# EAGLE design Chestnut V2.0 (EAGLE 7.7.0)

## Sheet 1 of 8
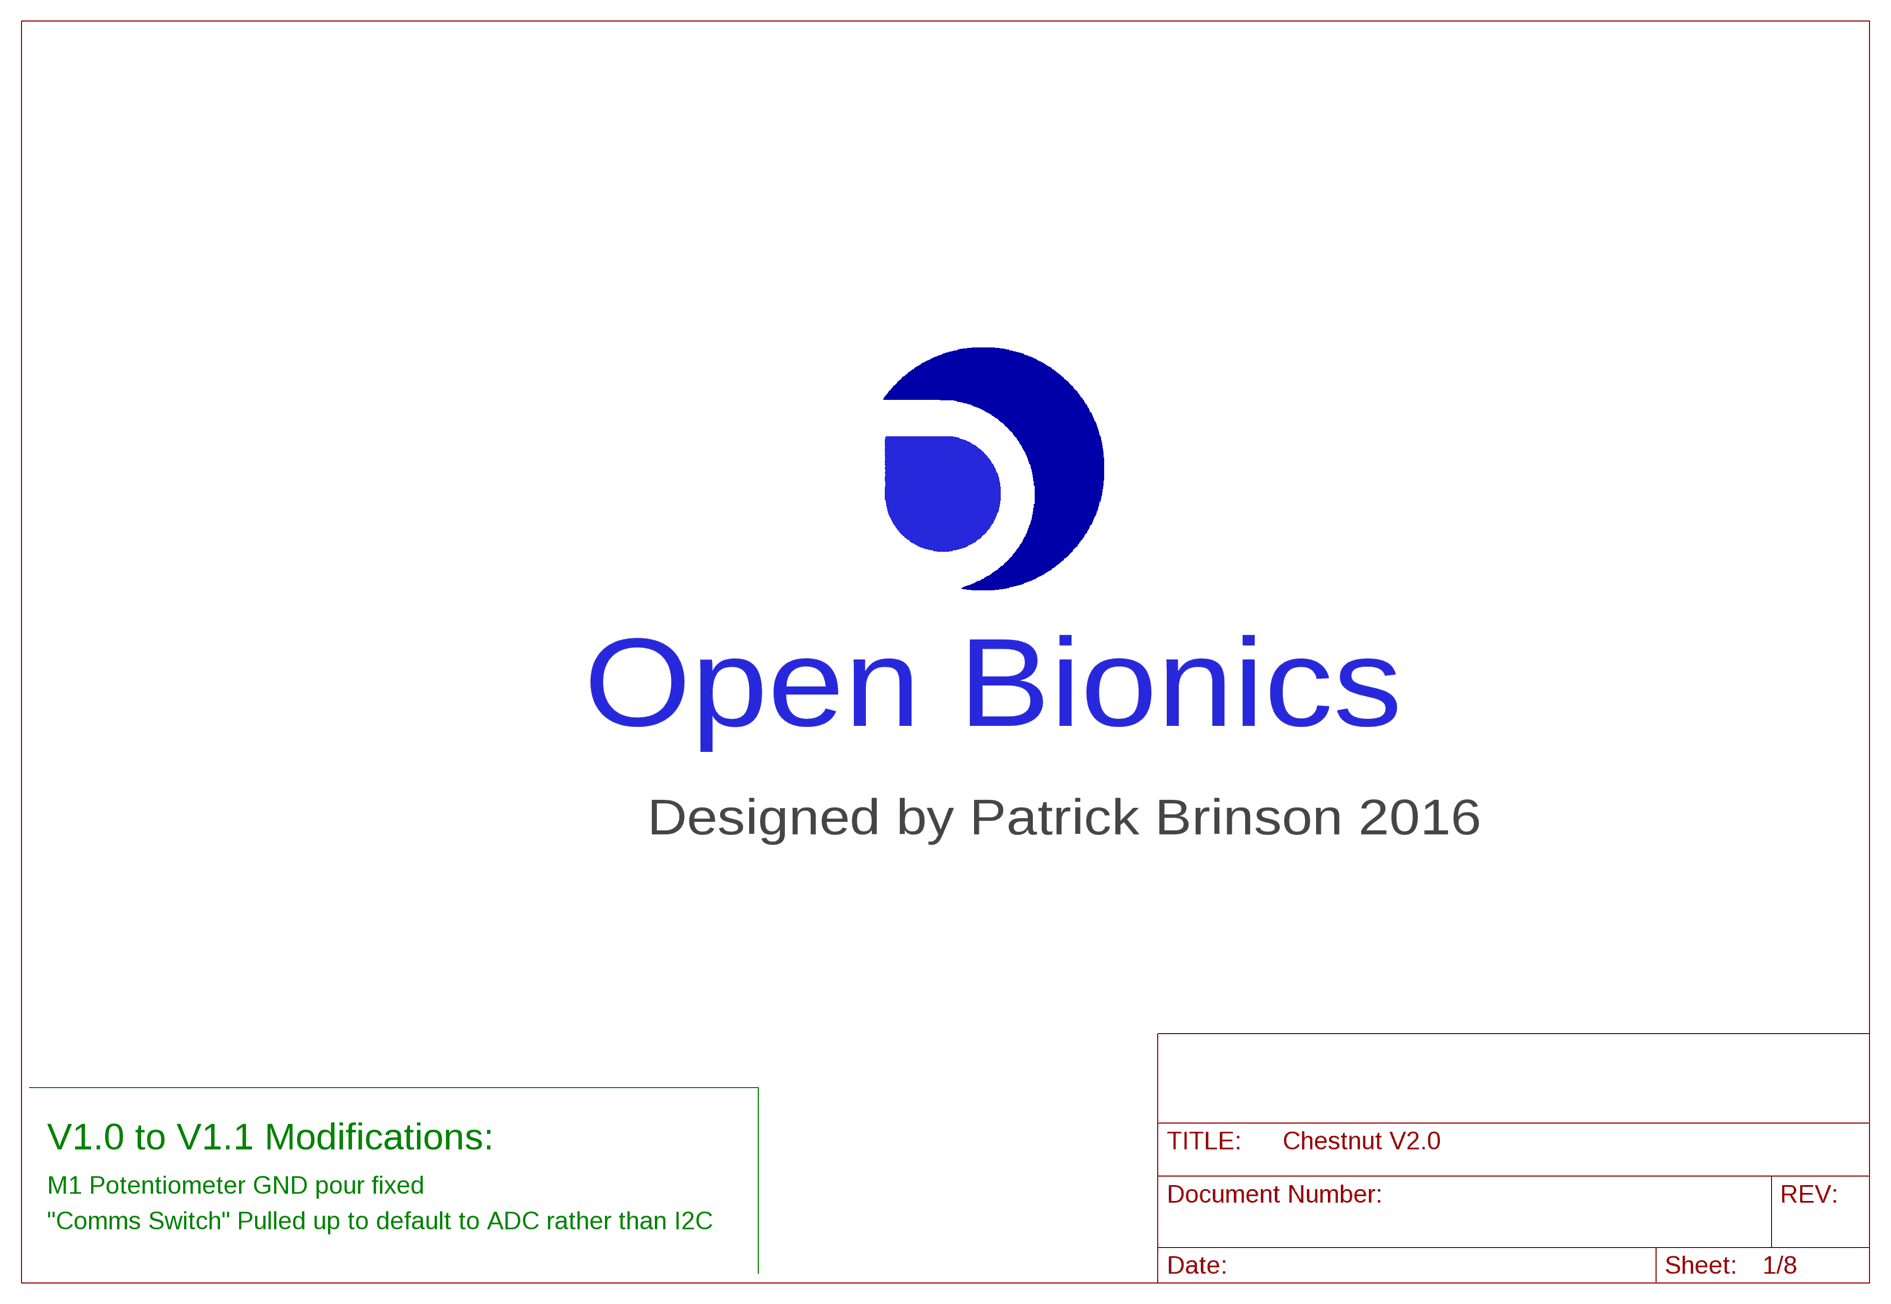
[diagram p0: schematic, sheet 1]

### Notes on the sheet
- Open Bionics
- Designed by Patrick Brinson 2016
- V1.0 to V1.1 Modifications:
- M1 Potentiometer GND pour fixed
- "Comms Switch" Pulled up to default to ADC rather than I2C

## Sheet 2 of 8: COMMS
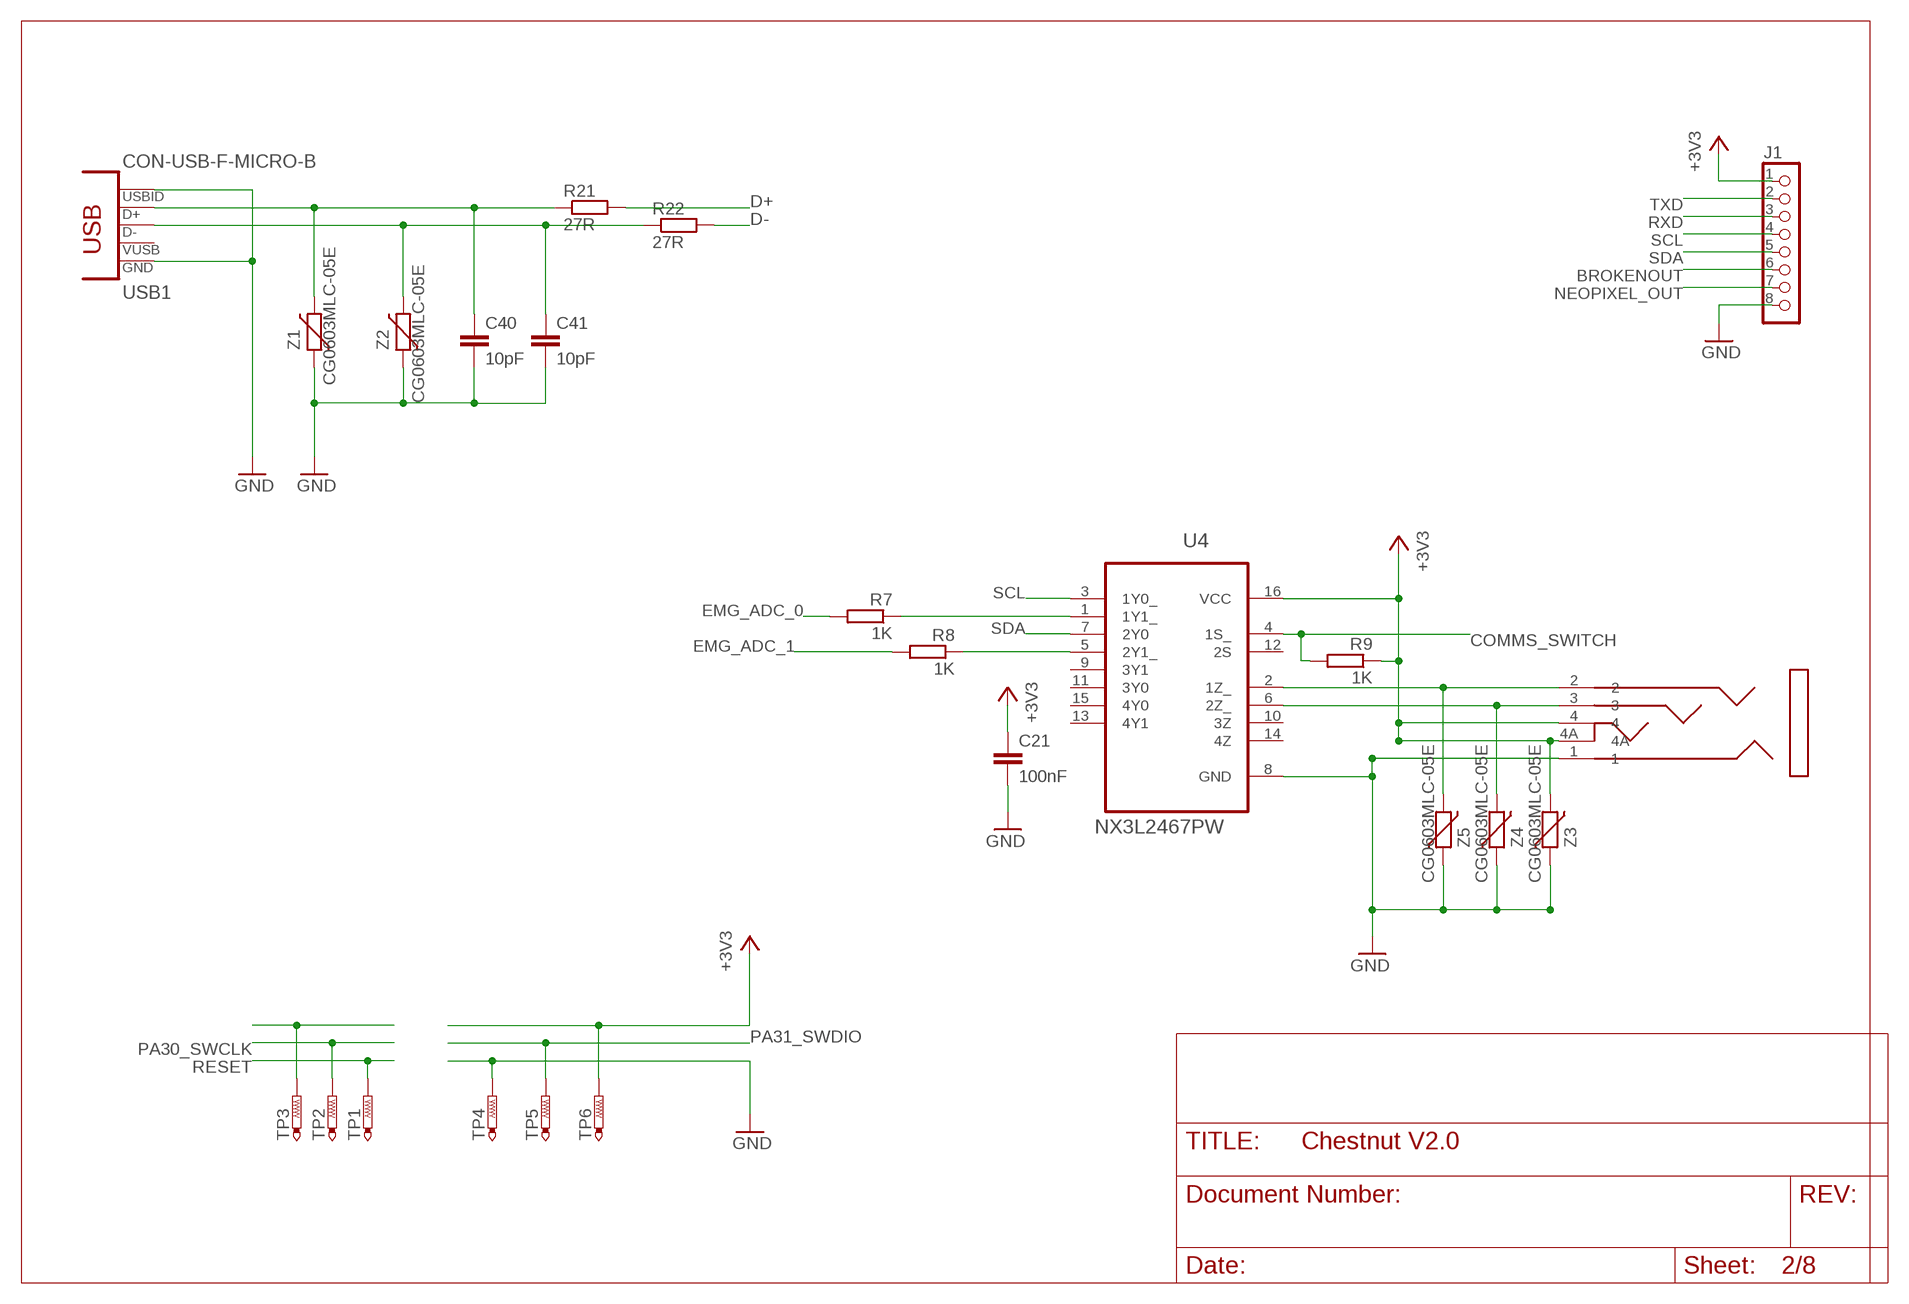
[diagram p1: schematic, sheet 2]

### Parts
C21  100nF  C-EUC0402  [C0402]
C40  10pF  C-EUC0402  [C0402]
C41  10pF  C-EUC0402  [C0402]
J1  CON_HEADER_1X08-PTH  [M1X8]
R7  1K  R-EU_R0402  [R0402]
R8  1K  R-EU_R0402  [R0402]
R9  1K  R-EU_R0402  [R0402]
R21  27R  R-EU_R0402  [R0402]
R22  27R  R-EU_R0402  [R0402]
TP1  PTR1TP11R  [TP11R]
TP2  PTR1TP11R  [TP11R]
TP3  PTR1TP11R  [TP11R]
TP4  PTR1TP11R  [TP11R]
TP5  PTR1TP11R  [TP11R]
TP6  PTR1TP11R  [TP11R]
U4  NX3L2467PW  [SOP65P640X110-16N]
U$7  LUMBERG_1503-13-VP3  [LUMBERG_1503-13-VP3]
USB1  CON-USB-F-MICRO-B  [CONN_USB_MICRO-B]
Z1  CG0603MLC-05E  VARISTORCN0603  [CT/CN0603]
Z2  CG0603MLC-05E  VARISTORCN0603  [CT/CN0603]
Z3  CG0603MLC-05E  VARISTORCN0603  [CT/CN0603]
Z4  CG0603MLC-05E  VARISTORCN0603  [CT/CN0603]
Z5  CG0603MLC-05E  VARISTORCN0603  [CT/CN0603]

### Nets
+3V3: C21.1 J1.1 R9.1 TP6.TP U4.16(VCC) U$7.4 U$7.4A Z3.2 ; also sheet 3,4,5,6,7,8
BROKENOUT: J1.6 ; also sheet 4
COMMS_SWITCH: R9.2 U4.4(1S_) ; also sheet 4
D+: R21.2 ; also sheet 4
D-: R22.2 ; also sheet 4
EMG_ADC_0: R7.2 ; also sheet 4
EMG_ADC_1: R8.2 ; also sheet 4
GND: C21.2 C40.2 C41.2 J1.8 TP4.TP U4.8(GND) U$7.1 USB1.P4(USBID) USB1.P5(GND) Z1.1 Z2.1 Z3.1 Z4.1 Z5.1 ; also sheet 3,4,5,6,7,8
N$10: TP3.TP
N$11: U4.6(2Z_) U$7.3 Z4.2
N$14: C41.1 R22.1 USB1.P2(D-) Z2.2
N$15: C40.1 R21.1 USB1.P3(D+) Z1.2
N$17: U4.2(1Z_) U$7.2 Z5.2
N$25: R7.1 U4.1(1Y1_)
N$26: R8.1 U4.5(2Y1_)
NEOPIXEL_OUT: J1.7 ; also sheet 8
PA30_SWCLK: TP2.TP ; also sheet 4
PA31_SWDIO: TP5.TP ; also sheet 4
RESET: TP1.TP ; also sheet 4
RXD: J1.3 ; also sheet 4
SCL: J1.4 U4.3(1Y0_) ; also sheet 4,8
SDA: J1.5 U4.7(2Y0) ; also sheet 4,8
TXD: J1.2 ; also sheet 4
Unconnected: U4.9(3Y1) U4.10(3Z) U4.11(3Y0) U4.12(2S) U4.13(4Y1) U4.14(4Z) U4.15(4Y0) USB1.BODY@1(BODY) USB1.BODY@2(BODY) USB1.BODY@3(BODY) USB1.BODY@4(BODY) USB1.P1(VUSB)

## Sheet 3 of 8: POWER
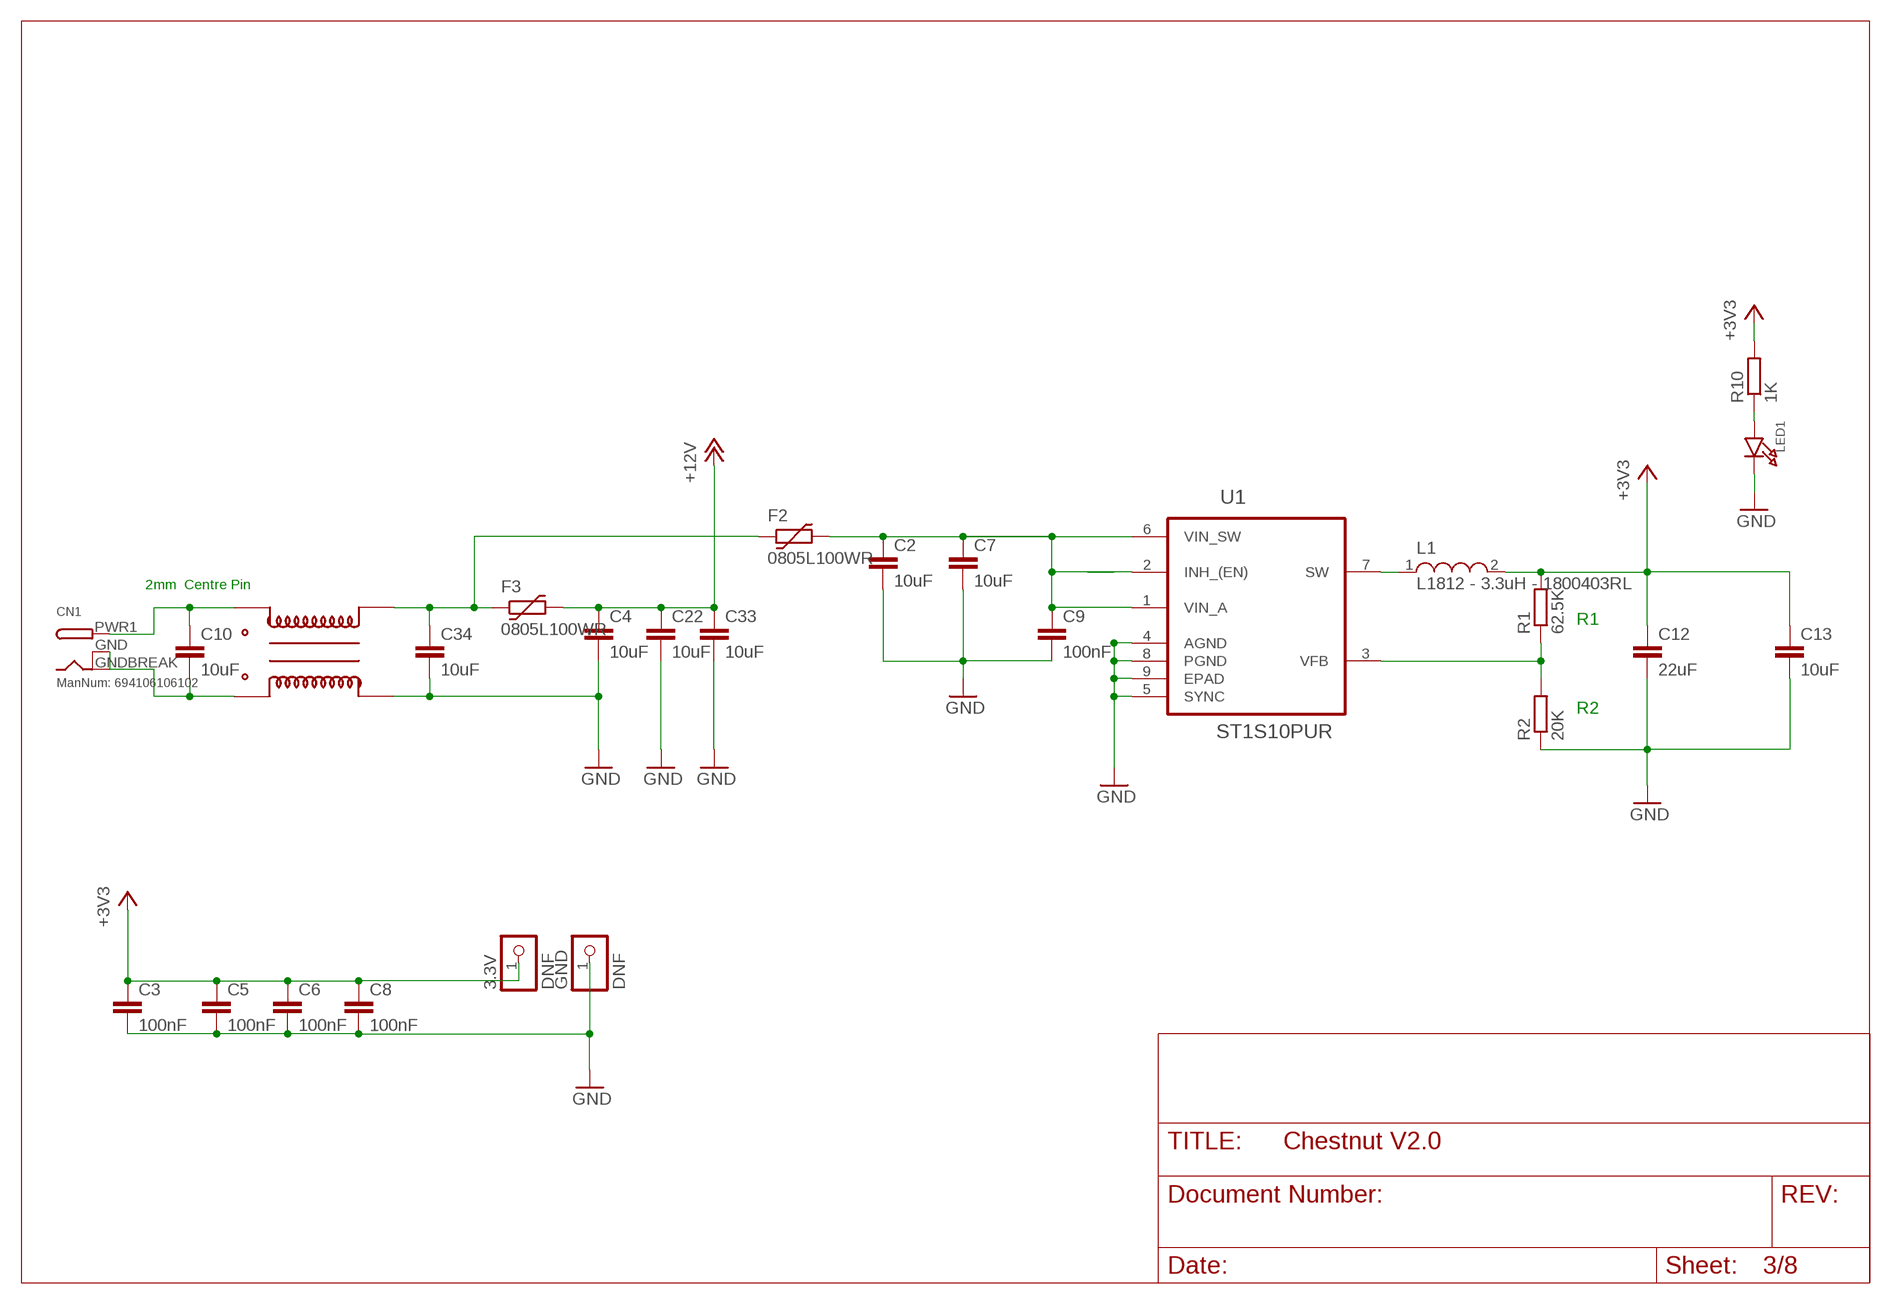
[diagram p2: schematic, sheet 3]

### Parts
3.3V  DNF  HEADER-1X1ROUND  [1X01_ROUND]
C2  10uF  C-EUC0805  [C0805]
C3  100nF  C-EUC0402  [C0402]
C4  10uF  C-EUC0805  [C0805]
C5  100nF  C-EUC0402  [C0402]
C6  100nF  C-EUC0402  [C0402]
C7  10uF  C-EUC0805  [C0805]
C8  100nF  C-EUC0402  [C0402]
C9  100nF  C-EUC0402  [C0402]
C10  10uF  C-EUC0805  [C0805]
C12  22uF  C-EUC1210  [C1210]
C13  10uF  C-EUC0805  [C0805]
C22  10uF  C-EUC0805  [C0805]
C33  10uF  C-EUC0805  [C0805]
C34  10uF  C-EUC0805  [C0805]
CN1  ManNum: 694106106102  DCBARRELSMT  [DCJACK_2MM_SMT]
F2  0805L100WR  FUSE_PTC-0805  [PTC0805]
F3  0805L100WR  FUSE_PTC-0805  [PTC0805]
GND  DNF  HEADER-1X1ROUND  [1X01_ROUND]
L1  L1812 - 3.3uH - 1800403RL  INDUCTOR-L1812  [L1812]
LED1  LED0603  [CHIPLED_0603]
R1  62.5K  R-EU_R0603  [R0603]
R2  20K  R-EU_R0603  [R0603]
R10  1K  R-EU_R0402  [R0402]
U1  ST1S10PUR  [DFN400X400X100-9N]
U$5  DLW5BTN501SQ2L  [DLW5BTN501SQ2L]

### Nets
12VFUSED: C2.1 C7.1 C9.1 F2.2 U1.1(VIN_A) U1.2(INH_(EN)) U1.6(VIN_SW)
+3V3: 3.3V.1 C3.1 C5.1 C6.1 C8.1 C12.1 C13.1 L1.2 R1.2 R10.2 ; also sheet 2,4,5,6,7,8
+12V: C4.1 C22.1 C33.1 F3.2 ; also sheet 5,6
GND: C2.2 C3.2 C4.2 C5.2 C6.2 C7.2 C8.2 C9.2 C12.2 C13.2 C22.2 C33.2 C34.2 GND.1 LED1.C R2.1 U1.4(AGND) U1.5(SYNC) U1.8(PGND) U1.9(EPAD) U$5.4 ; also sheet 2,4,5,6,7,8
N$2: LED1.A R10.1
N$3: L1.1 U1.7(SW)
N$5: C34.1 F2.1 F3.1 U$5.2
N$6: R1.1 R2.2 U1.3(VFB)
N$18: C10.2 CN1.GND(GNDBREAK) CN1.GNDBREAK(GND) U$5.3
N$19: C10.1 CN1.PWR1(PWR) U$5.1

### Notes on the sheet
- 2mm  Centre Pin
- R1
- R2

## Sheet 4 of 8: ATMEGA 2560
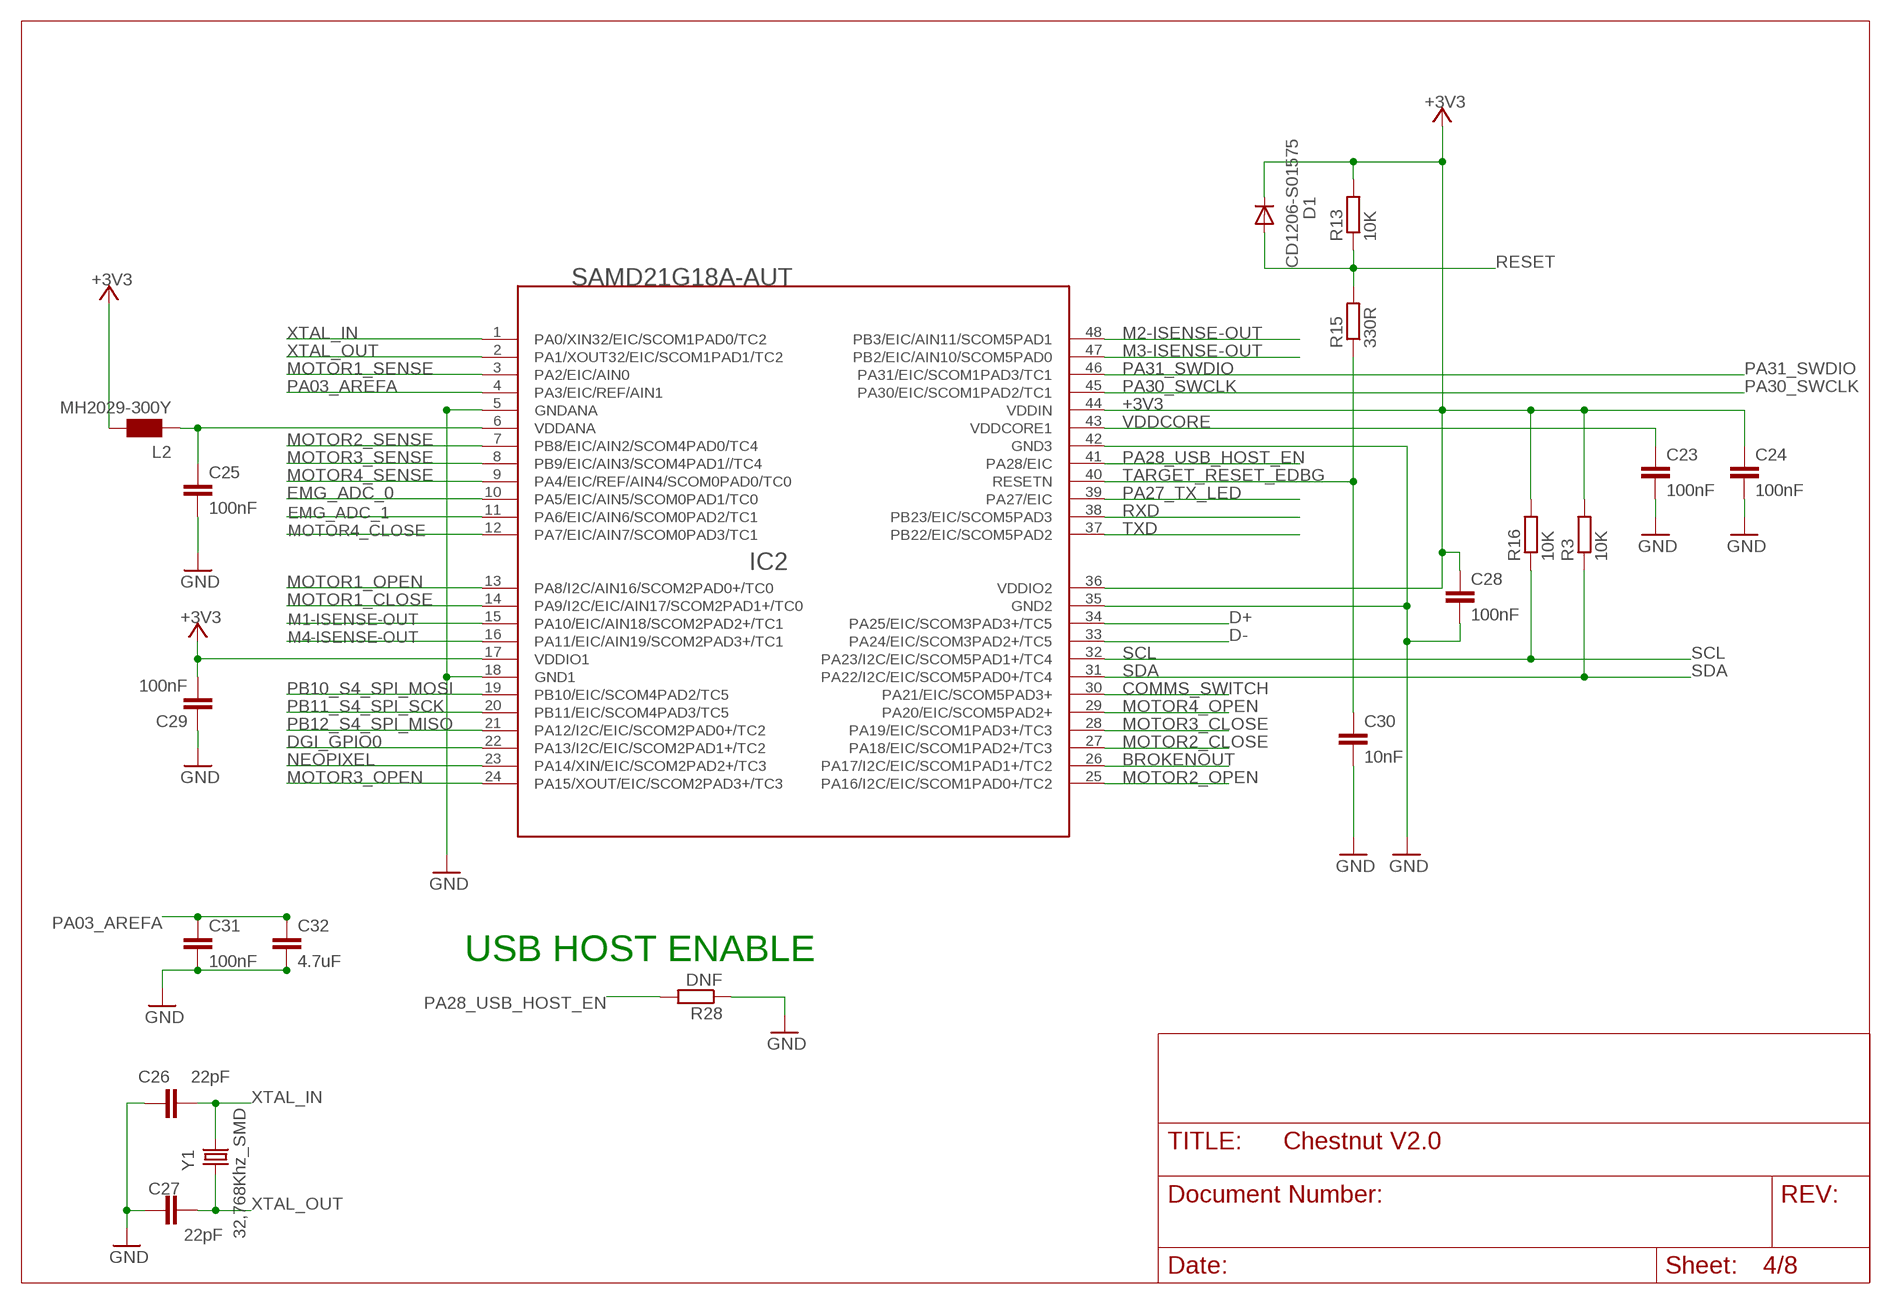
[diagram p3: schematic, sheet 4]

### Parts
C23  100nF  C-EUC0402  [C0402]
C24  100nF  C-EUC0402  [C0402]
C25  100nF  C-EUC0402  [C0402]
C26  22pF  C-EUC0402  [C0402]
C27  22pF  C-EUC0402  [C0402]
C28  100nF  C-EUC0402  [C0402]
C29  100nF  C-EUC0402  [C0402]
C30  10nF  C-EUC0402  [C0402]
C31  100nF  C-EUC0402  [C0402]
C32  4.7uF  C-EUC0603  [C0603]
D1  CD1206-S01575  0012_CD1206-S01575  [MINIMELF]
IC2  SAMD21G18A-AUT  INTEGRATEDCIRCUITS_1792_SAMD21G18A-AUT  [INTEGRATEDCIRCUITS_TQFP48-7X7]
L2  MH2029-300Y  0001_BLM21PG300SN1D_/_MH2029-300Y  [0805]
R3  10K  R-EU_R0402  [R0402]
R13  10K  R-EU_R0402  [R0402]
R15  330R  R-EU_R0402  [R0402]
R16  10K  R-EU_R0402  [R0402]
R28  DNF  R-EU_R0402  [R0402]
Y1  32,768Khz_SMD  0213_ABS07-32.768KHZ-T  [RESONATOR_EPSON_FC_145]

### Nets
+3V3: C24.1 C28.1 C29.2 D1.C IC2.17(VDDIO1) IC2.36(VDDIO2) IC2.44(VDDIN) L2.2 R3.2 R13.2 R16.2 ; also sheet 2,3,5,6,7,8
BROKENOUT: IC2.26(PA17/I2C/EIC/SCOM1PAD1+/TC2) ; also sheet 2
COMMS_SWITCH: IC2.30(PA21/EIC/SCOM5PAD3+) ; also sheet 2
D+: IC2.34(PA25/EIC/SCOM3PAD3+/TC5) ; also sheet 2
D-: IC2.33(PA24/EIC/SCOM3PAD2+/TC5) ; also sheet 2
DGI_GPIO0: IC2.22(PA13/I2C/EIC/SCOM2PAD1+/TC2)
EMG_ADC_0: IC2.10(PA5/EIC/AIN5/SCOM0PAD1/TC0) ; also sheet 2
EMG_ADC_1: IC2.11(PA6/EIC/AIN6/SCOM0PAD2/TC1) ; also sheet 2
GND: C23.2 C24.2 C25.2 C26.1 C27.1 C28.2 C29.1 C30.2 C31.2 C32.2 IC2.5(GNDANA) IC2.18(GND1) IC2.35(GND2) IC2.42(GND3) R28.1 ; also sheet 2,3,5,6,7,8
M1-ISENSE-OUT: IC2.15(PA10/EIC/AIN18/SCOM2PAD2+/TC1) ; also sheet 7
M2-ISENSE-OUT: IC2.48(PB3/EIC/AIN11/SCOM5PAD1) ; also sheet 7
M3-ISENSE-OUT: IC2.47(PB2/EIC/AIN10/SCOM5PAD0) ; also sheet 7
M4-ISENSE-OUT: IC2.16(PA11/EIC/AIN19/SCOM2PAD3+/TC1) ; also sheet 7
MOTOR1_CLOSE: IC2.14(PA9/I2C/EIC/AIN17/SCOM2PAD1+/TC0) ; also sheet 5
MOTOR1_OPEN: IC2.13(PA8/I2C/AIN16/SCOM2PAD0+/TC0) ; also sheet 5
MOTOR1_SENSE: IC2.3(PA2/EIC/AIN0) ; also sheet 5
MOTOR2_CLOSE: IC2.27(PA18/EIC/SCOM1PAD2+/TC3) ; also sheet 5
MOTOR2_OPEN: IC2.25(PA16/I2C/EIC/SCOM1PAD0+/TC2) ; also sheet 5
MOTOR2_SENSE: IC2.7(PB8/EIC/AIN2/SCOM4PAD0/TC4) ; also sheet 5
MOTOR3_CLOSE: IC2.28(PA19/EIC/SCOM1PAD3+/TC3) ; also sheet 6
MOTOR3_OPEN: IC2.24(PA15/XOUT/EIC/SCOM2PAD3+/TC3) ; also sheet 6
MOTOR3_SENSE: IC2.8(PB9/EIC/AIN3/SCOM4PAD1//TC4) ; also sheet 6
MOTOR4_CLOSE: IC2.12(PA7/EIC/AIN7/SCOM0PAD3/TC1) ; also sheet 6
MOTOR4_OPEN: IC2.29(PA20/EIC/SCOM5PAD2+) ; also sheet 6
MOTOR4_SENSE: IC2.9(PA4/EIC/REF/AIN4/SCOM0PAD0/TC0) ; also sheet 6
N$12: C25.1 IC2.6(VDDANA) L2.1
NEOPIXEL: IC2.23(PA14/XIN/EIC/SCOM2PAD2+/TC3) ; also sheet 8
PA03_AREFA: C31.1 C32.1 IC2.4(PA3/EIC/REF/AIN1)
PA27_TX_LED: IC2.39(PA27/EIC)
PA28_USB_HOST_EN: IC2.41(PA28/EIC) R28.2
PA30_SWCLK: IC2.45(PA30/EIC/SCOM1PAD2/TC1) ; also sheet 2
PA31_SWDIO: IC2.46(PA31/EIC/SCOM1PAD3/TC1) ; also sheet 2
PB10_S4_SPI_MOSI: IC2.19(PB10/EIC/SCOM4PAD2/TC5)
PB11_S4_SPI_SCK: IC2.20(PB11/EIC/SCOM4PAD3/TC5)
PB12_S4_SPI_MISO: IC2.21(PA12/I2C/EIC/SCOM2PAD0+/TC2)
RESET: D1.A R13.1 R15.2 ; also sheet 2
RXD: IC2.38(PB23/EIC/SCOM5PAD3) ; also sheet 2
SCL: IC2.32(PA23/I2C/EIC/SCOM5PAD1+/TC4) R16.1 ; also sheet 2,8
SDA: IC2.31(PA22/I2C/EIC/SCOM5PAD0+/TC4) R3.1 ; also sheet 2,8
TARGET_RESET_EDBG: C30.1 IC2.40(RESETN) R15.1
TXD: IC2.37(PB22/EIC/SCOM5PAD2) ; also sheet 2
VDDCORE: C23.1 IC2.43(VDDCORE1)
XTAL_IN: C26.2 IC2.1(PA0/XIN32/EIC/SCOM1PAD0/TC2) Y1.P$2
XTAL_OUT: C27.2 IC2.2(PA1/XOUT32/EIC/SCOM1PAD1/TC2) Y1.P$1

### Notes on the sheet
- USB HOST ENABLE

## Sheet 5 of 8: MOTOR 1&2
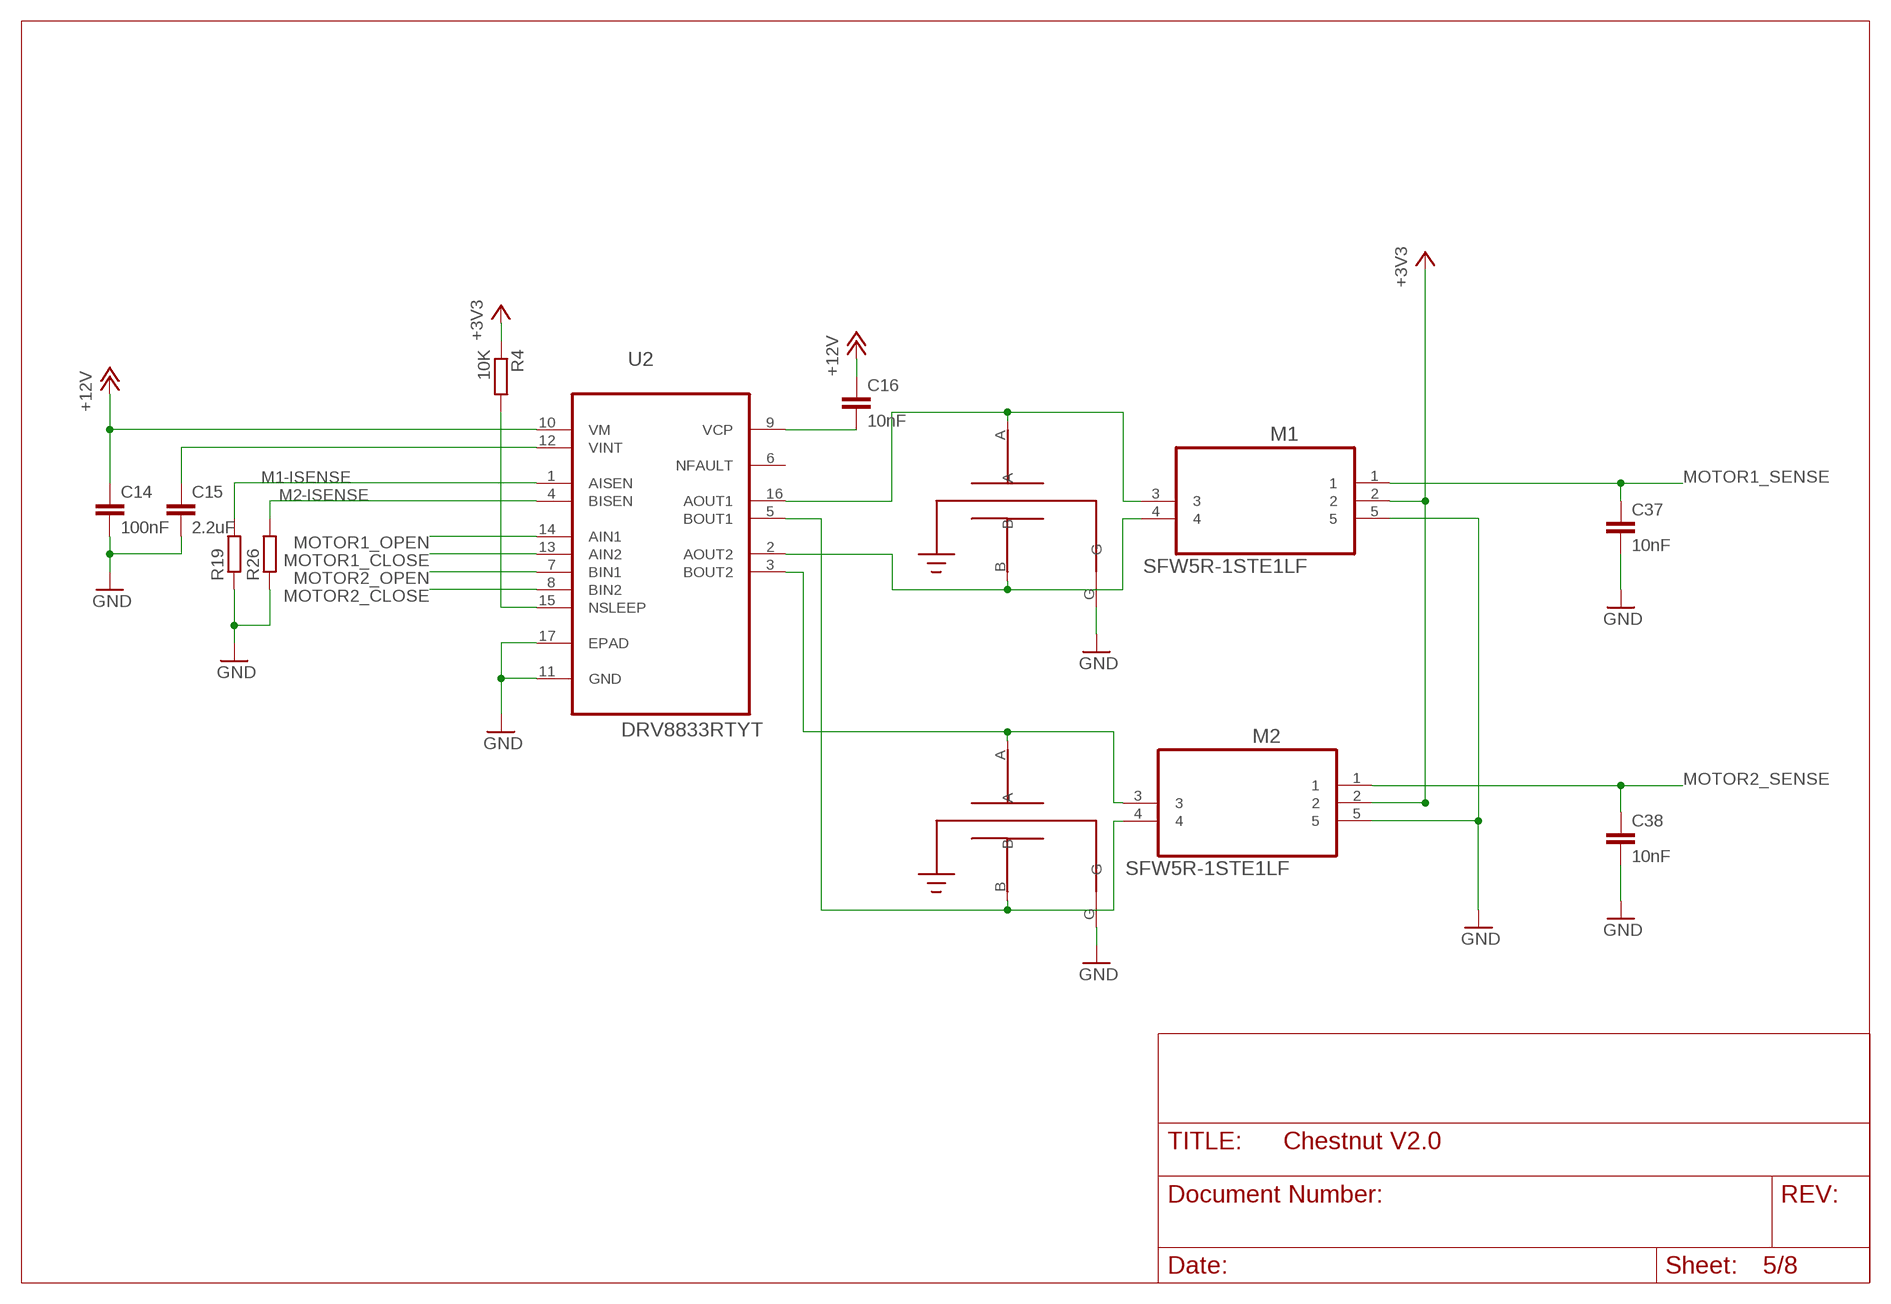
[diagram p4: schematic, sheet 5]

### Parts
C14  100nF  C-EUC0402  [C0402]
C15  2.2uF  C-EUC0603  [C0603]
C16  10nF  C-EUC0402  [C0402]
C37  10nF  C-EUC0402  [C0402]
C38  10nF  C-EUC0402  [C0402]
M1  SFW5R-1STE1LF  [FCI_SFW5R-1STE1LF]
M2  SFW5R-1STE1LF  [FCI_SFW5R-1STE1LF]
R4  10K  R-EU_R0402  [R0402]
R19  R-EU_R0805  [R0805]
R26  R-EU_R0805  [R0805]
U2  DRV8833RTYT  [QFN65P400X400X80-17N]
U$8  101X14N330MV4T_X2Y_0603  [101X14N330MV4T_X2Y_0603]
U$19  101X14N330MV4T_X2Y_0603  [101X14N330MV4T_X2Y_0603]

### Nets
+3V3: M1.2 M2.2 R4.1 ; also sheet 2,3,4,6,7,8
+12V: C14.1 C16.1 U2.10(VM) ; also sheet 3,6
GND: C14.2 C15.2 C37.2 C38.2 M1.5 M2.5 R19.1 R26.1 U2.11(GND) U2.17(EPAD) U$8.G U$19.G ; also sheet 2,3,4,6,7,8
M1-ISENSE: R19.2 U2.1(AISEN) ; also sheet 7
M2-ISENSE: R26.2 U2.4(BISEN) ; also sheet 7
MOTOR1_CLOSE: U2.13(AIN2) ; also sheet 4
MOTOR1_OPEN: U2.14(AIN1) ; also sheet 4
MOTOR1_SENSE: C37.1 M1.1 ; also sheet 4
MOTOR2_CLOSE: U2.8(BIN2) ; also sheet 4
MOTOR2_OPEN: U2.7(BIN1) ; also sheet 4
MOTOR2_SENSE: C38.1 M2.1 ; also sheet 4
N$8: C16.2 U2.9(VCP)
N$33: M1.3 U2.16(AOUT1) U$19.A
N$34: M1.4 U2.2(AOUT2) U$19.B
N$35: M2.4 U2.5(BOUT1) U$8.B
N$36: M2.3 U2.3(BOUT2) U$8.A
N$38: R4.2 U2.15(NSLEEP)
N$42: C15.1 U2.12(VINT)
Unconnected: U2.6(NFAULT)

## Sheet 6 of 8: MOTOR 3&4
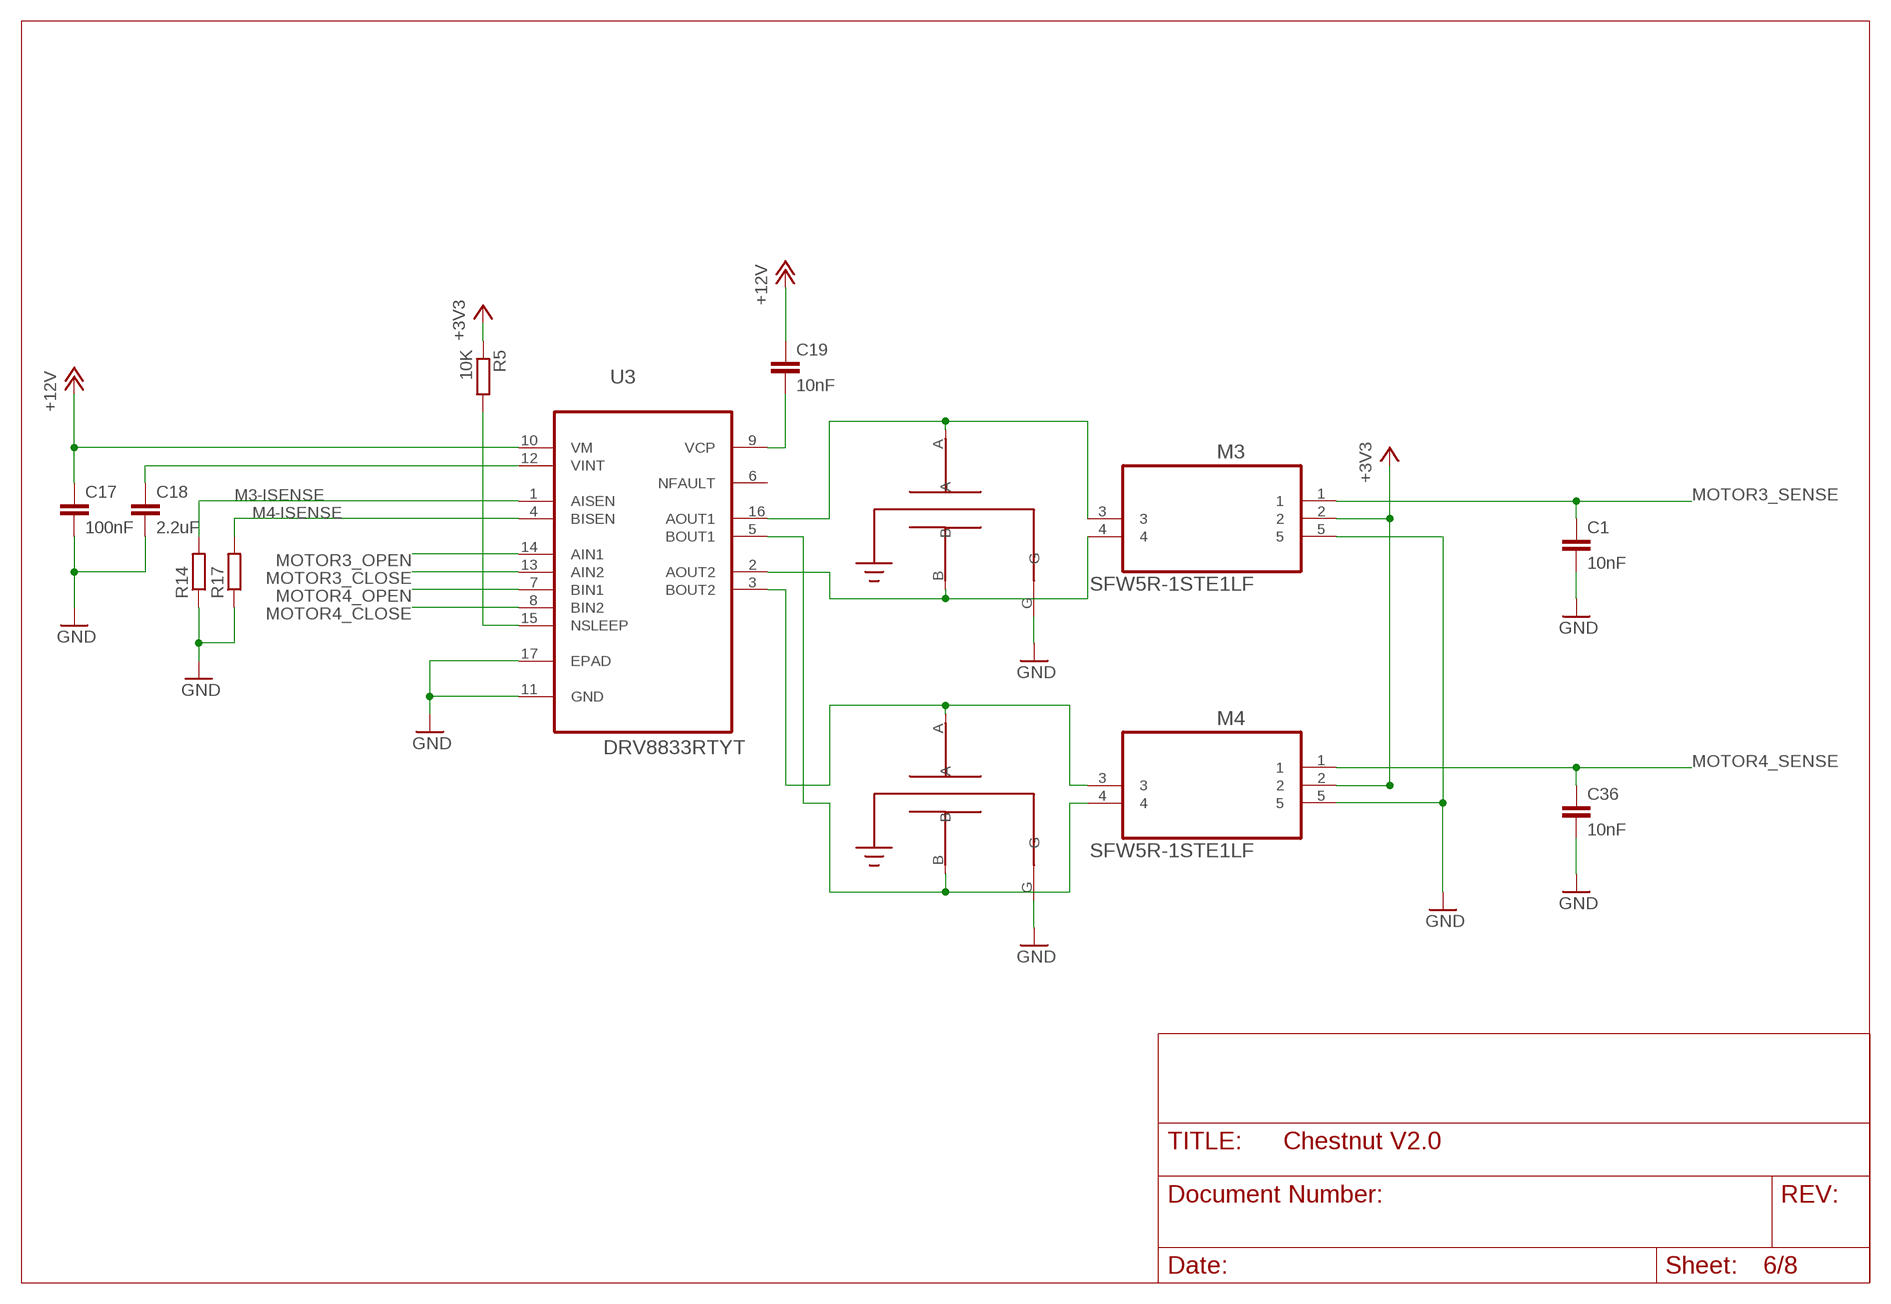
[diagram p5: schematic, sheet 6]

### Parts
C1  10nF  C-EUC0402  [C0402]
C17  100nF  C-EUC0402  [C0402]
C18  2.2uF  C-EUC0603  [C0603]
C19  10nF  C-EUC0402  [C0402]
C36  10nF  C-EUC0402  [C0402]
M3  SFW5R-1STE1LF  [FCI_SFW5R-1STE1LF]
M4  SFW5R-1STE1LF  [FCI_SFW5R-1STE1LF]
R5  10K  R-EU_R0402  [R0402]
R14  R-EU_R0805  [R0805]
R17  R-EU_R0805  [R0805]
U3  DRV8833RTYT  [QFN65P400X400X80-17N]
U$9  101X14N330MV4T_X2Y_0603  [101X14N330MV4T_X2Y_0603]
U$10  101X14N330MV4T_X2Y_0603  [101X14N330MV4T_X2Y_0603]

### Nets
+3V3: M3.2 M4.2 R5.1 ; also sheet 2,3,4,5,7,8
+12V: C17.1 C19.1 U3.10(VM) ; also sheet 3,5
GND: C1.2 C17.2 C18.2 C36.2 M3.5 M4.5 R14.1 R17.1 U3.11(GND) U3.17(EPAD) U$9.G U$10.G ; also sheet 2,3,4,5,7,8
M3-ISENSE: R14.2 U3.1(AISEN) ; also sheet 7
M4-ISENSE: R17.2 U3.4(BISEN) ; also sheet 7
MOTOR3_CLOSE: U3.13(AIN2) ; also sheet 4
MOTOR3_OPEN: U3.14(AIN1) ; also sheet 4
MOTOR3_SENSE: C1.1 M3.1 ; also sheet 4
MOTOR4_CLOSE: U3.8(BIN2) ; also sheet 4
MOTOR4_OPEN: U3.7(BIN1) ; also sheet 4
MOTOR4_SENSE: C36.1 M4.1 ; also sheet 4
N$23: M3.3 U3.16(AOUT1) U$9.A
N$30: M3.4 U3.2(AOUT2) U$9.B
N$31: M4.4 U3.5(BOUT1) U$10.B
N$32: M4.3 U3.3(BOUT2) U$10.A
N$43: C19.2 U3.9(VCP)
N$44: C18.1 U3.12(VINT)
N$45: R5.2 U3.15(NSLEEP)
Unconnected: U3.6(NFAULT)

## Sheet 7 of 8
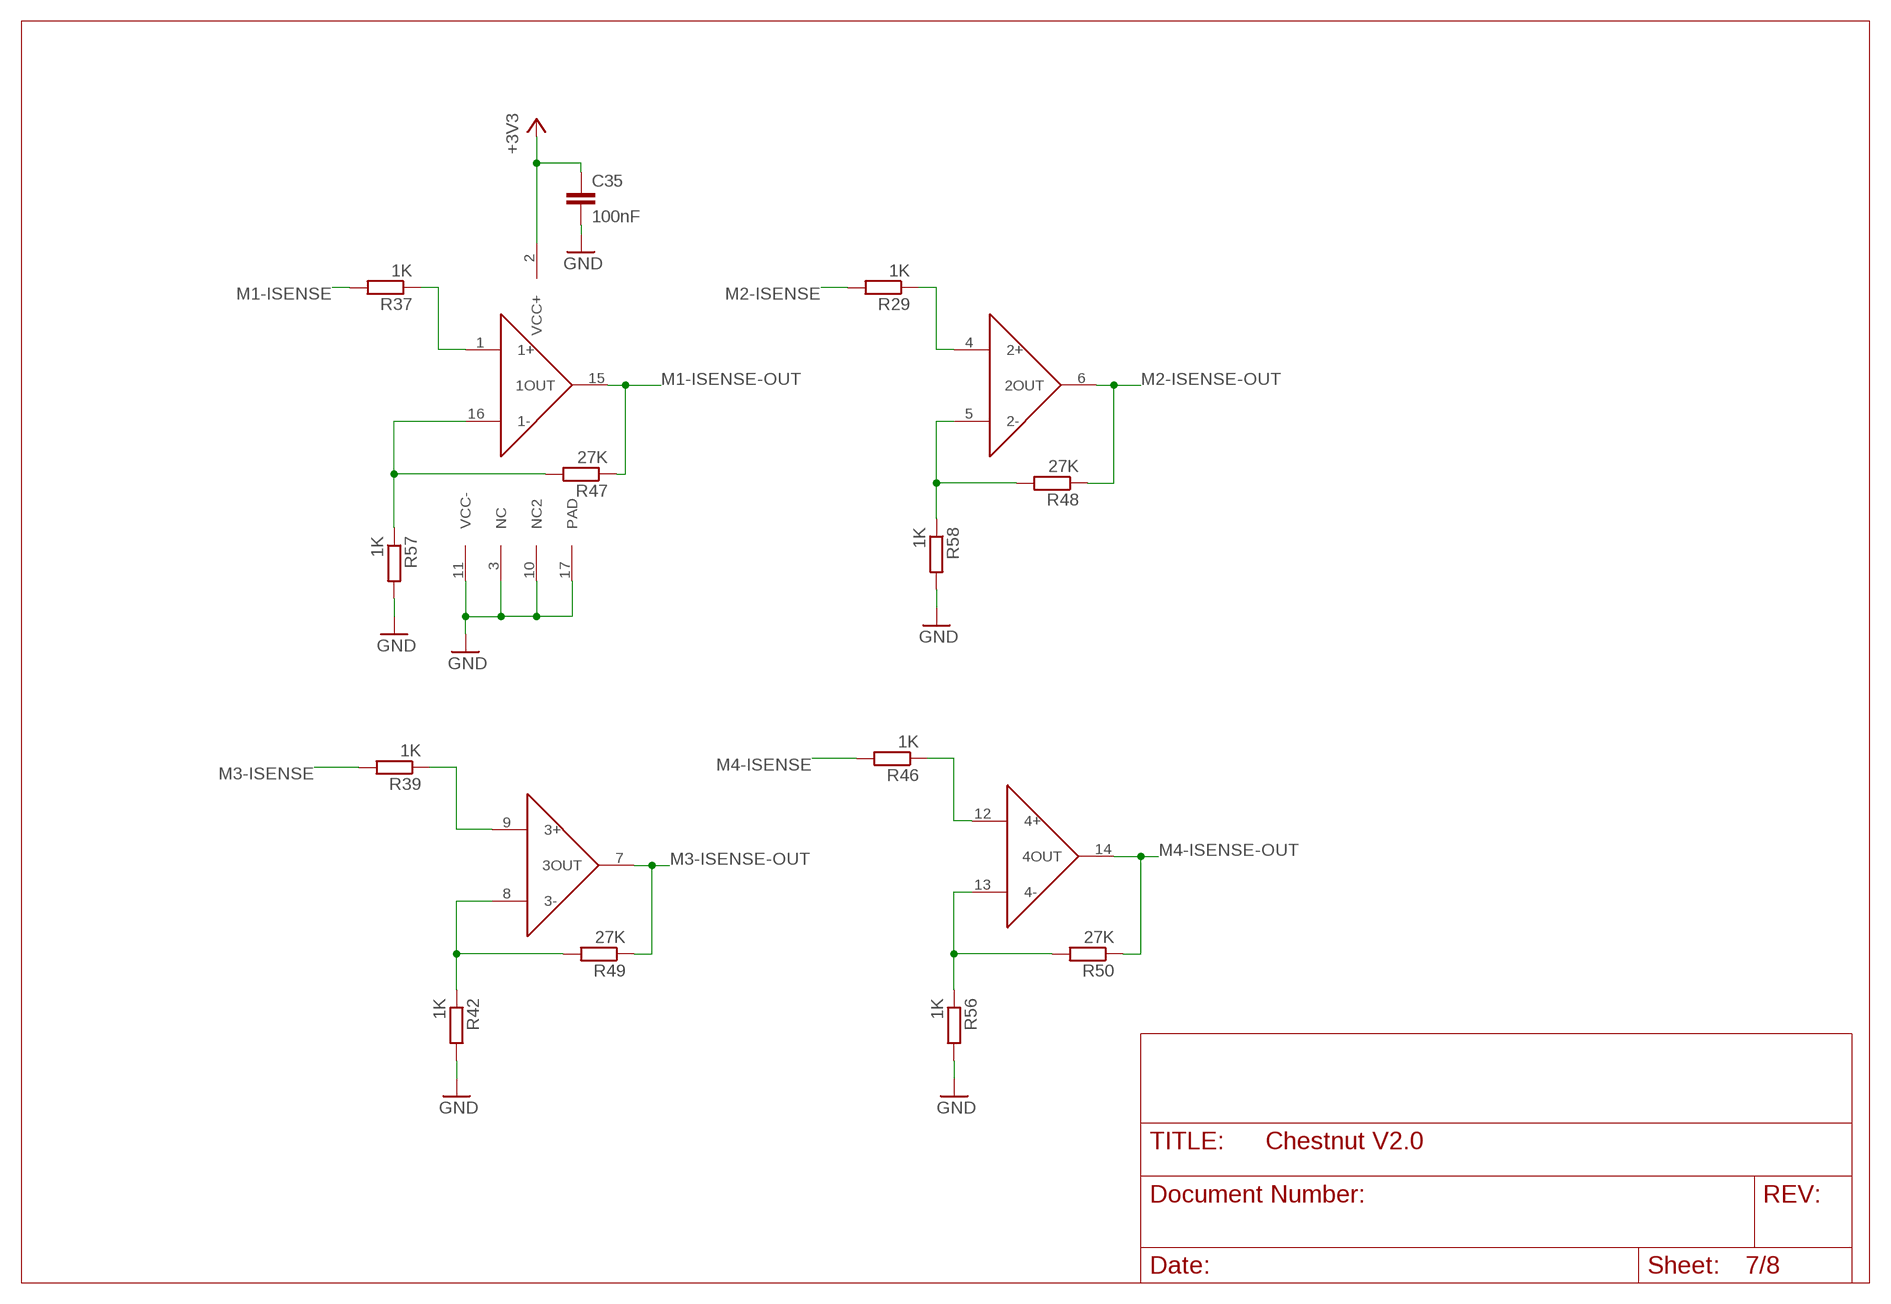
[diagram p6: schematic, sheet 7]

### Parts
C35  100nF  C-EUC0402  [C0402]
R29  1K  R-EU_R0402  [R0402]
R37  1K  R-EU_R0402  [R0402]
R39  1K  R-EU_R0402  [R0402]
R42  1K  R-EU_R0402  [R0402]
R46  1K  R-EU_R0402  [R0402]
R47  27K  R-EU_R0402  [R0402]
R48  27K  R-EU_R0402  [R0402]
R49  27K  R-EU_R0402  [R0402]
R50  27K  R-EU_R0402  [R0402]
R56  1K  R-EU_R0402  [R0402]
R57  1K  R-EU_R0402  [R0402]
R58  1K  R-EU_R0402  [R0402]
U$15  TSZ124IQ4T  [TSZ124IQ4T]

### Nets
+3V3: C35.1 U$15.2(VCC+) ; also sheet 2,3,4,5,6,8
GND: C35.2 R42.2 R56.2 R57.2 R58.2 U$15.3(NC) U$15.10(NC2) U$15.11(VCC-) U$15.17(PAD) ; also sheet 2,3,4,5,6,8
M1-ISENSE: R37.2 ; also sheet 5
M1-ISENSE-OUT: R47.1 U$15.15(1OUT) ; also sheet 4
M2-ISENSE: R29.2 ; also sheet 5
M2-ISENSE-OUT: R48.1 U$15.6(2OUT) ; also sheet 4
M3-ISENSE: R39.2 ; also sheet 6
M3-ISENSE-OUT: R49.1 U$15.7(3OUT) ; also sheet 4
M4-ISENSE: R46.2 ; also sheet 6
M4-ISENSE-OUT: R50.1 U$15.14(4OUT) ; also sheet 4
N$7: R37.1 U$15.1(1+)
N$22: R29.1 U$15.4(2+)
N$24: R39.1 U$15.9(3+)
N$27: R47.2 R57.1 U$15.16(1-)
N$29: R46.1 U$15.12(4+)
N$66: R48.2 R58.1 U$15.5(2-)
N$67: R42.1 R49.2 U$15.8(3-)
N$68: R50.2 R56.1 U$15.13(4-)

## Sheet 8 of 8: Perhiperals
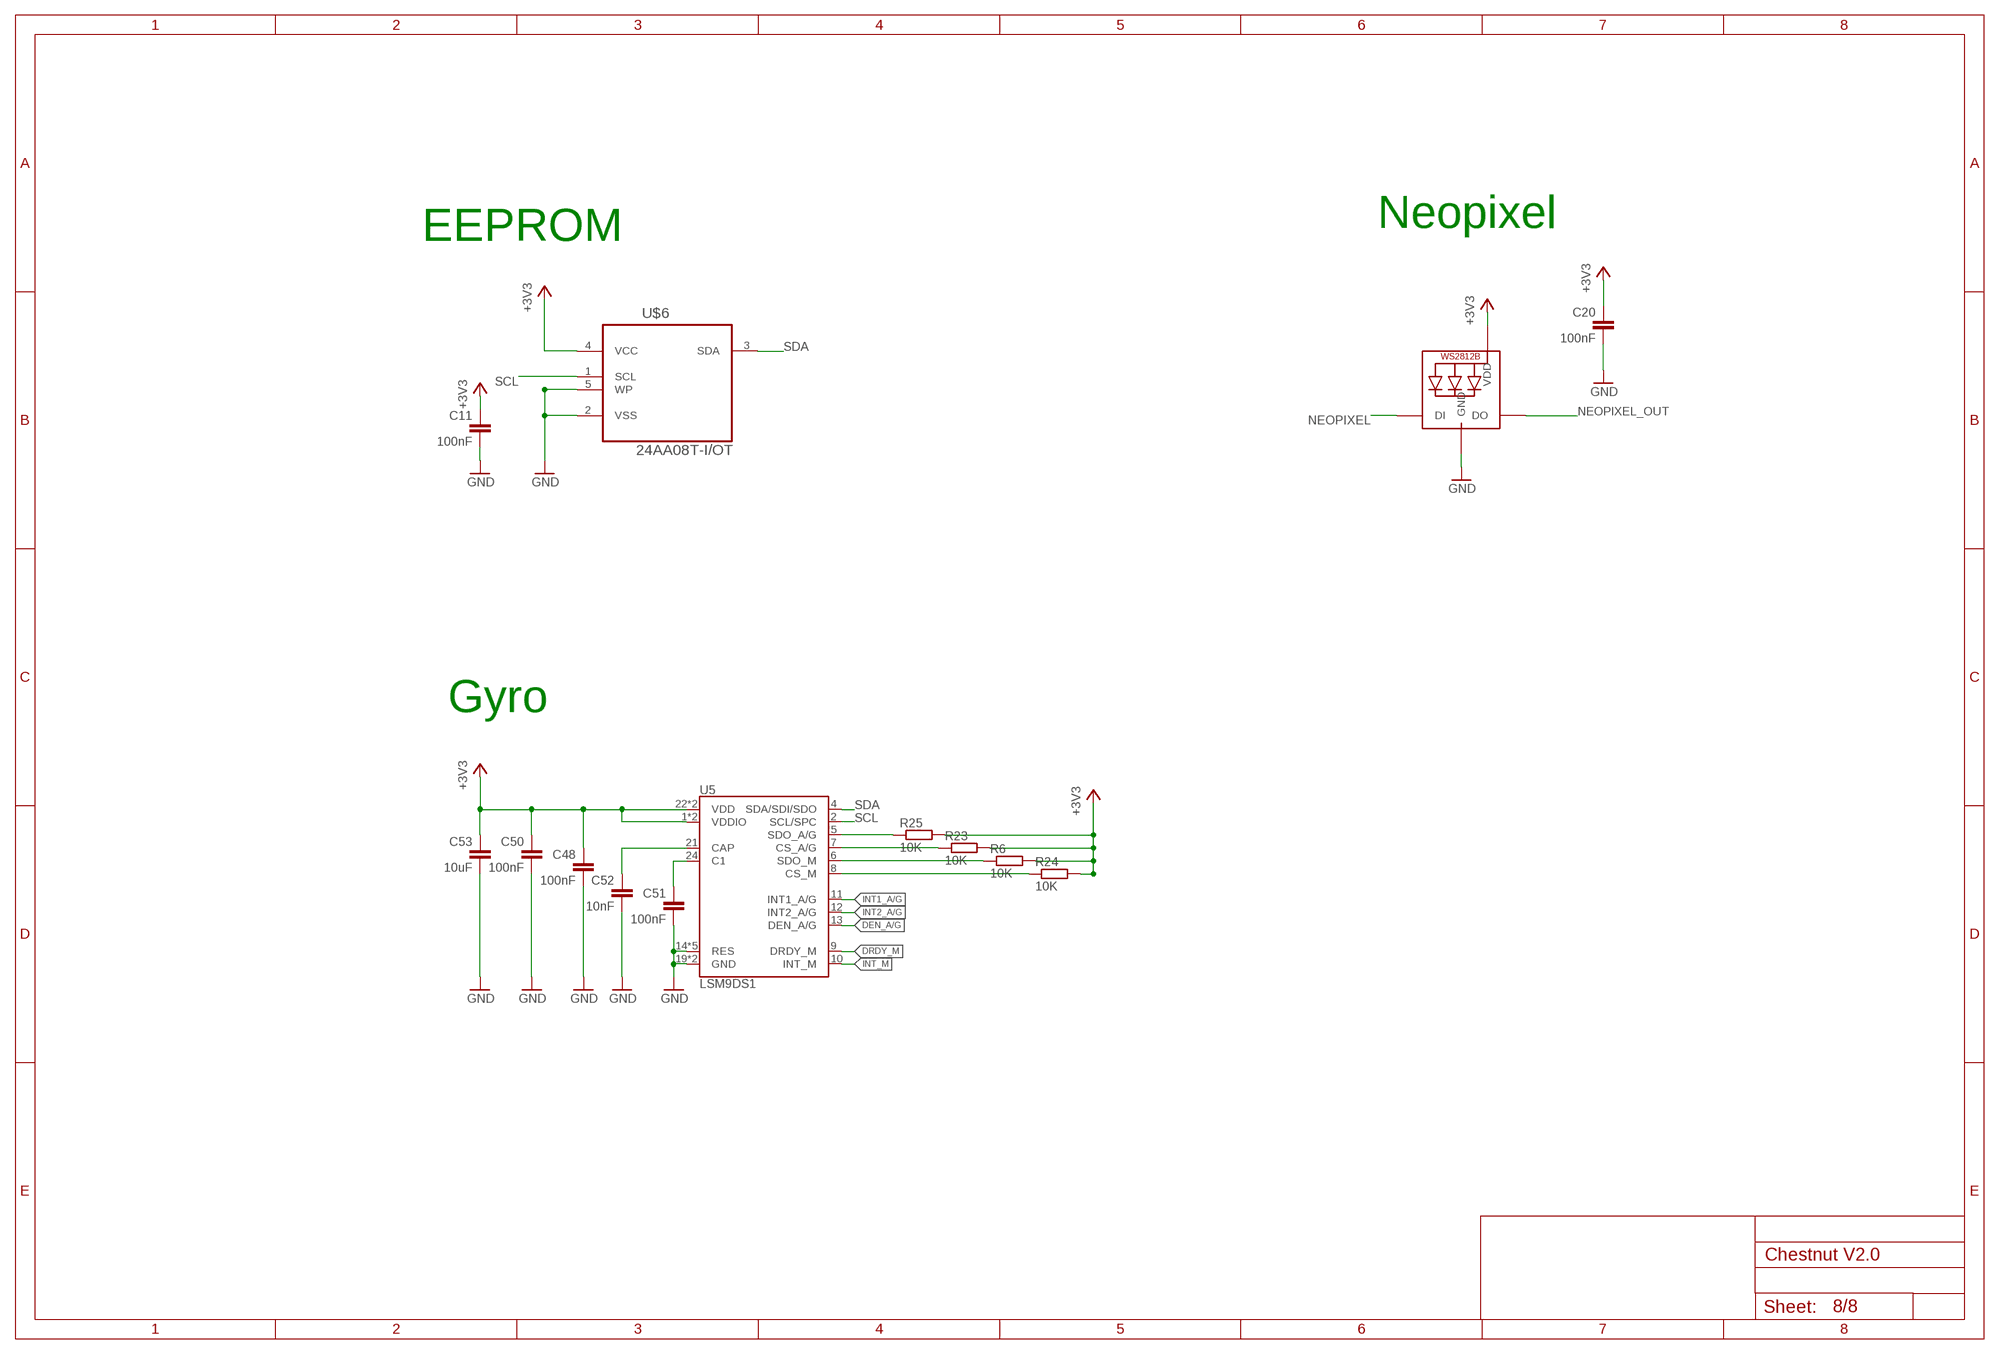
[diagram p7: schematic, sheet 8]

### Parts
C11  100nF  C-EUC0402  [C0402]
C20  100nF  C-EUC0402  [C0402]
C48  100nF  C-EUC0402  [C0402]
C50  100nF  C-EUC0402  [C0402]
C51  100nF  C-EUC0402  [C0402]
C52  10nF  C-EUC0402  [C0402]
C53  10uF  C-EUC0805  [C0805]
LED2  WS2812B3535  [LED3535]
R6  10K  R-EU_R0402  [R0402]
R23  10K  R-EU_R0402  [R0402]
R24  10K  R-EU_R0402  [R0402]
R25  10K  R-EU_R0402  [R0402]
U5  LSM9DS1  [LGA24-8X4]
U$6  24AA08T-I/OT  [SOT95P290X145-5N]

### Nets
+3V3: C11.1 C20.1 C48.1 C50.1 C53.1 LED2.2(VDD) R6.2 R23.2 R24.2 R25.2 U5.1(VDDIO) U5.3(VDDIO) U5.22(VDD) U5.23(VDD) U$6.4(VCC) ; also sheet 2,3,4,5,6,7
C1: C51.1 U5.24(C1)
CAP: C52.1 U5.21(CAP)
DEN_A/G: U5.13(DEN_A/G)
DRDY_M: U5.9(DRDY_M)
GND: C11.2 C20.2 C48.2 C50.2 C51.2 C52.2 C53.2 LED2.4(GND) U5.14(RES) U5.15(RES) U5.16(RES) U5.17(RES) U5.18(RES) U5.19(GND) U5.20(GND) U$6.2(VSS) U$6.5(WP) ; also sheet 2,3,4,5,6,7
INT1_A/G: U5.11(INT1_A/G)
INT2_A/G: U5.12(INT2_A/G)
INT_M: U5.10(INT_M)
N$62: R25.1 U5.5(SDO_A/G)
N$63: R23.1 U5.7(CS_A/G)
N$64: R6.1 U5.6(SDO_M)
N$65: R24.1 U5.8(CS_M)
NEOPIXEL: LED2.1(DI) ; also sheet 4
NEOPIXEL_OUT: LED2.3(DO) ; also sheet 2
SCL: U5.2(SCL/SPC) U$6.1(SCL) ; also sheet 2,4
SDA: U5.4(SDA/SDI/SDO) U$6.3(SDA) ; also sheet 2,4

### Notes on the sheet
- EEPROM | Neopixel
- Gyro

## Library data of the parts
3.3V GND = microbuilder:HEADER-1X1: PIN HEADER
C1-C38 C40 C41 C48 C50-C53 = resistor:C-EU: CAPACITOR, European symbol
CN1 = adafruit:DCBARREL: 2.0mm DC Barrel Jack DCJACK_2MM_PTH - Through Hole Jack (4UConnector: 05537)
D1 = Diodi:0012_CD1206-S01575: small-signal high-speed Switching Diodes CD1206; CASE: 1206; MONTHLY_USAGE: _____; PART_NUMBER: CD1206-S01575; PRICE: _____; SUPPLIER: _____; TYPE: Diodi
F2 F3 = dp_devices:FUSE_PTC: Resettable PTC
IC2 = ZERO V1.1  4Motor Conflict:INTEGRATEDCIRCUITS_1792_SAMD21G18A-AUT: Atmel D21 32bit ARM Cortex-M0 microcontroller - 48 PIN TQFP 256KB flash memory + 32KB SRAM
J1 = dp_devices:CON_HEADER_1X08
L1 = dp_devices:INDUCTOR: Inductor
L2 = Protezione:0001_BLM21PG300SN1D_/_MH2029-300Y: BLM21; MONTHLY_USAGE: _____; PART_NUMBER: BLM21PG300SN1D_/_MH2029-300Y; PRICE: _____; SUPPLIER: _____; TYPE: Protezione
LED1 = 2mm connector:LED: LED 0603 - 0603 Surface Mount Package 2mA: Green LED - Low Power (3.9mcd, 2ma, 1.7Vf) - Digikey: 475-2709-2-ND Orange LED - Low Power (9.8mcd, 2ma, 1.8Vf) - Digikey: 475-1194-2-ND Red LED - Low Power (5mcd, 2ma, 1.8Vf) - Digikey: 475-1195-2-ND Yellow LED - Low Power (7mcd, 2ma, 1.8Vf) - Digikey: 475-1196-2-ND 5mA: Blue LED - Low Power (17mcd, 5ma, 2.9Vf) - Digikey: LNJ937W8CRACT-ND 0805 - 0805 Surface Mount Package 2mA: Red LED (8.8mcd, 2mA, 1.8Vf, Clear) - Low Power [Digikey: 475-2510-1-ND] Green LED (5mcd, 2mA, 1.8Vf, Clear) - Low Power [Digikey: 475-2730-1-ND] Yellow LED (11.3mcd, 2mA, 1.8Vf, Clear) - Low Power [Digikey: 475-2555-1-ND] 20mA: Red LED (104mcd, 20mA, Diffused) - LS R976 [Digikey: 475-1278-6-ND] Red LED (12mcd, 20mA, 2.0Vf, Clear) - APT2012EC [Digikey: 754-1128-1-ND] Green LED (15mcd, 20mA, 2.2Vf, Clear) - APT2012GC [Digikey: 754-1131-1-ND] Orange LED (160mcd, 20mA, 2.1Vf, Clear) - APT2012SECK [Digikey: 754-1130-1-ND] 1206 - 1206 Surface Mount Package Green LED (26mcd, 20mA, Diffused) - LG N971 [Digikey: 475-1407-6-ND] Red LED (15mcd, 20mA, Diffused) - LH N974 [Digikey: 475-1416-6-ND]
LED2 = adafruitnew:WS2812B
M1-M4 = Firgelli SFW5R-1STE1LF:SFW5R-1STE1LF: FFC/FPC CONNECTOR, RECEPTACLE, 5POS 1ROW; MPN: SFW5R-1STE1LF; OC_FARNELL: 1835598; OC_NEWARK: 62K5638; PACKAGE: CONNECTOR-5POS; SUPPLIER: FCI
R1-R10 R13-R17 R19 R21-R26 R28 R29 R37 R39 R42 R46-R50 R56-R58 = resistor:R-EU_: RESISTOR, European symbol
TP1-TP6 = testpad:PTR1: TEST PIN
U1 = ST1S10 8DFN:ST1S10PUR: BUCK, 2.5-18V, 900KHZ, 3A, 0.8V, 8DFN; MPN: ST1S10PUR; OC_FARNELL: 2253494; OC_NEWARK: 94W9598; PACKAGE: DFN8 (4 x 4 mm); SUPPLIER: STMicroelectronics
U2 U3 = DRV8833RTYT:DRV8833RTYT: DUAL H-BRIDGE MOTOR DRIVER,QFN-16; MPN: DRV8833RTYT; OC_FARNELL: 2057087; OC_NEWARK: 64T2942; PACKAGE: QFN-16; SUPPLIER: TEXAS INSTRUMENTS
U4 = NX3L2467PW:NX3L2467PW: Dual low-ohmic double-pole double-throw analog switch,TSSOP-16; MPN: NX3L2467PW; OC_FARNELL: 2164830; OC_NEWARK: 55W4275; PACKAGE: TSSOP-16; SUPPLIER: NXP
U5 = LSM9DS1_temp:LSM9DS1: LSM9DS1 3D accelerometer, gyroscope & magnetometer The LSM9DS1 is a system-in-package featuring a 3D digital linear acceleration sensor, a 3D digital angular rate sensor, and a 3D digital magnetic sensor. The LSM9DS1 has a linear acceleration full scale of ±2g/±4g/±8/±16 g, a magnetic field full scale of ±4/±8/±12/±16 gauss and an angular rate of ±245/±500/±2000 dps. The LSM9DS1 includes an I2 C serial bus interface supporting standard and fast mode (100 kHz and 400 kHz) and an SPI serial standard interface. Magnetic, accelerometer and gyroscope sensing can be enabled or set in power-down mode separately for smart power management. The LSM9DS1 is available in a plastic land grid array package (LGA) and it is guaranteed to operate over an extended temperature range from -40 °C to +85 °C.; PROD_ID: IC-12536
U$5 = DLW5BTN501SQ2L:DLW5BTN501SQ2L
U$6 = 24AA08T:24AA08T-I/OT: 8K I2C Serial EEPROM; MPN: 24AA08T-I/OT; OC_FARNELL: 1331283; OC_NEWARK: 92C6833; PACKAGE: SOT23-5; SUPPLIER: MICROCHIP
U$7 = LUMBERG_1503-13-VP3:LUMBERG_1503-13-VP3
U$8-U$10 U$19 = 101X14N330MV4T_X2Y_0603:101X14N330MV4T_X2Y_0603
U$15 = TSZ124IQ4T_V2:TSZ124IQ4T
USB1 = dp_devices:CON-USB-F: USB Female connector
Y1 = Cristalli:0213_ABS07-32.768KHZ-T: 32,768KHz - SMD; MONTHLY_USAGE: _____; PART_NUMBER: ABS07-32.768KHZ-T; PRICE: _____; SUPPLIER: _____; TYPE: Cristalli
Z1-Z5 = varistor:VARISTOR: VARISTOR

## Board
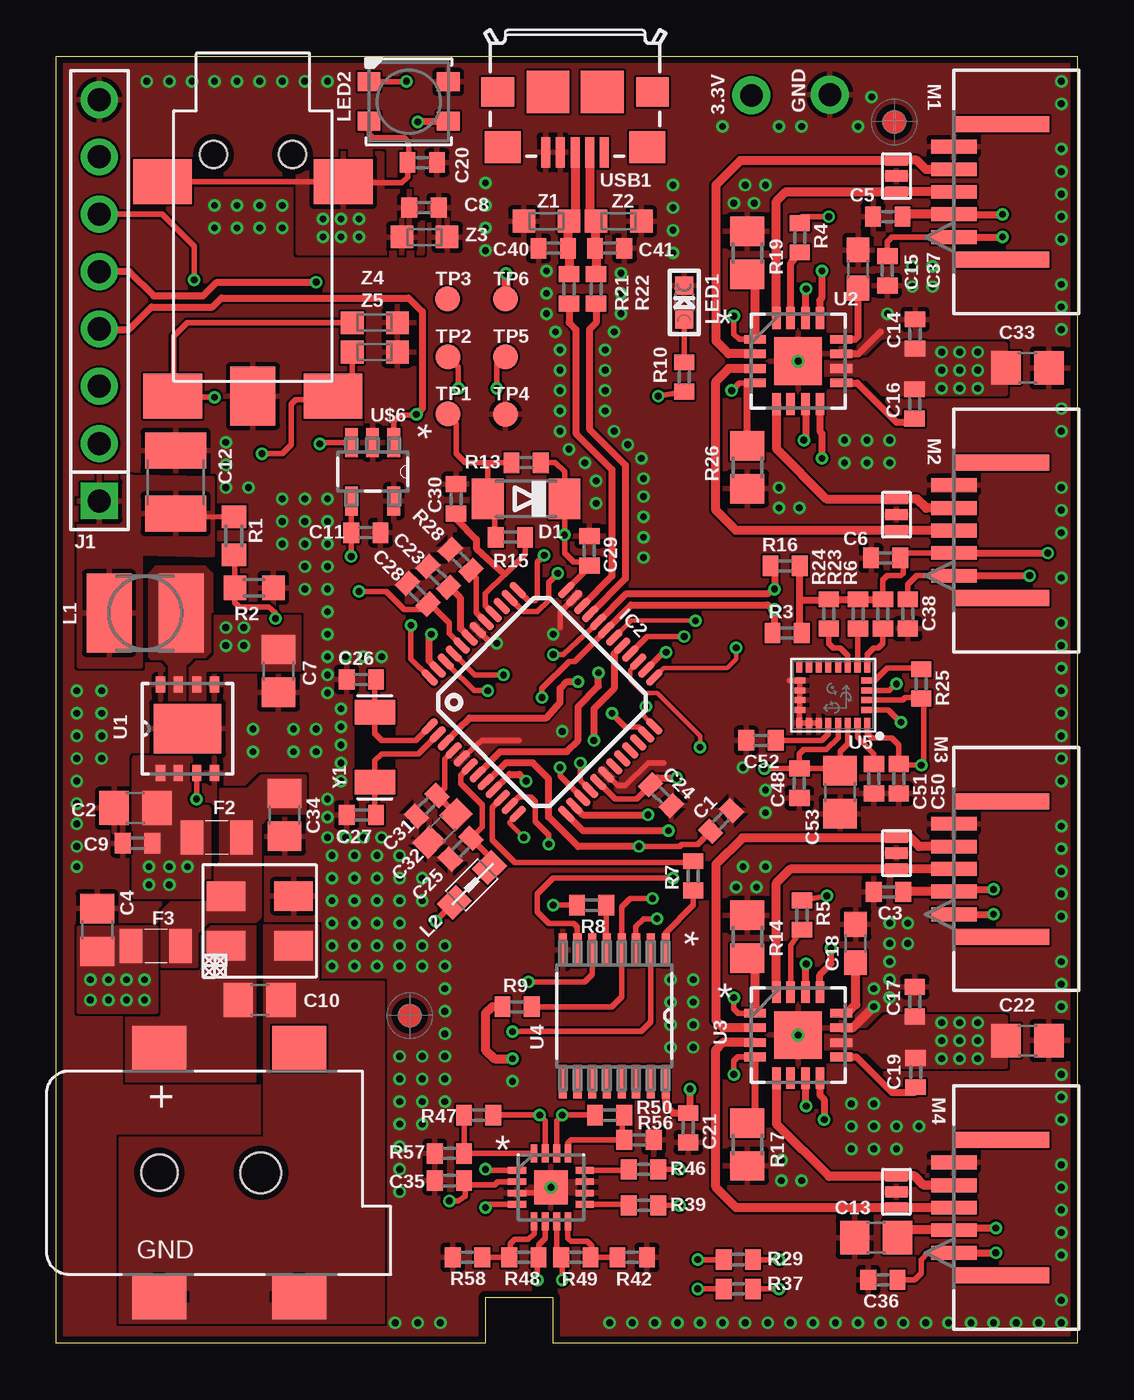
[diagram p8: board, top side]
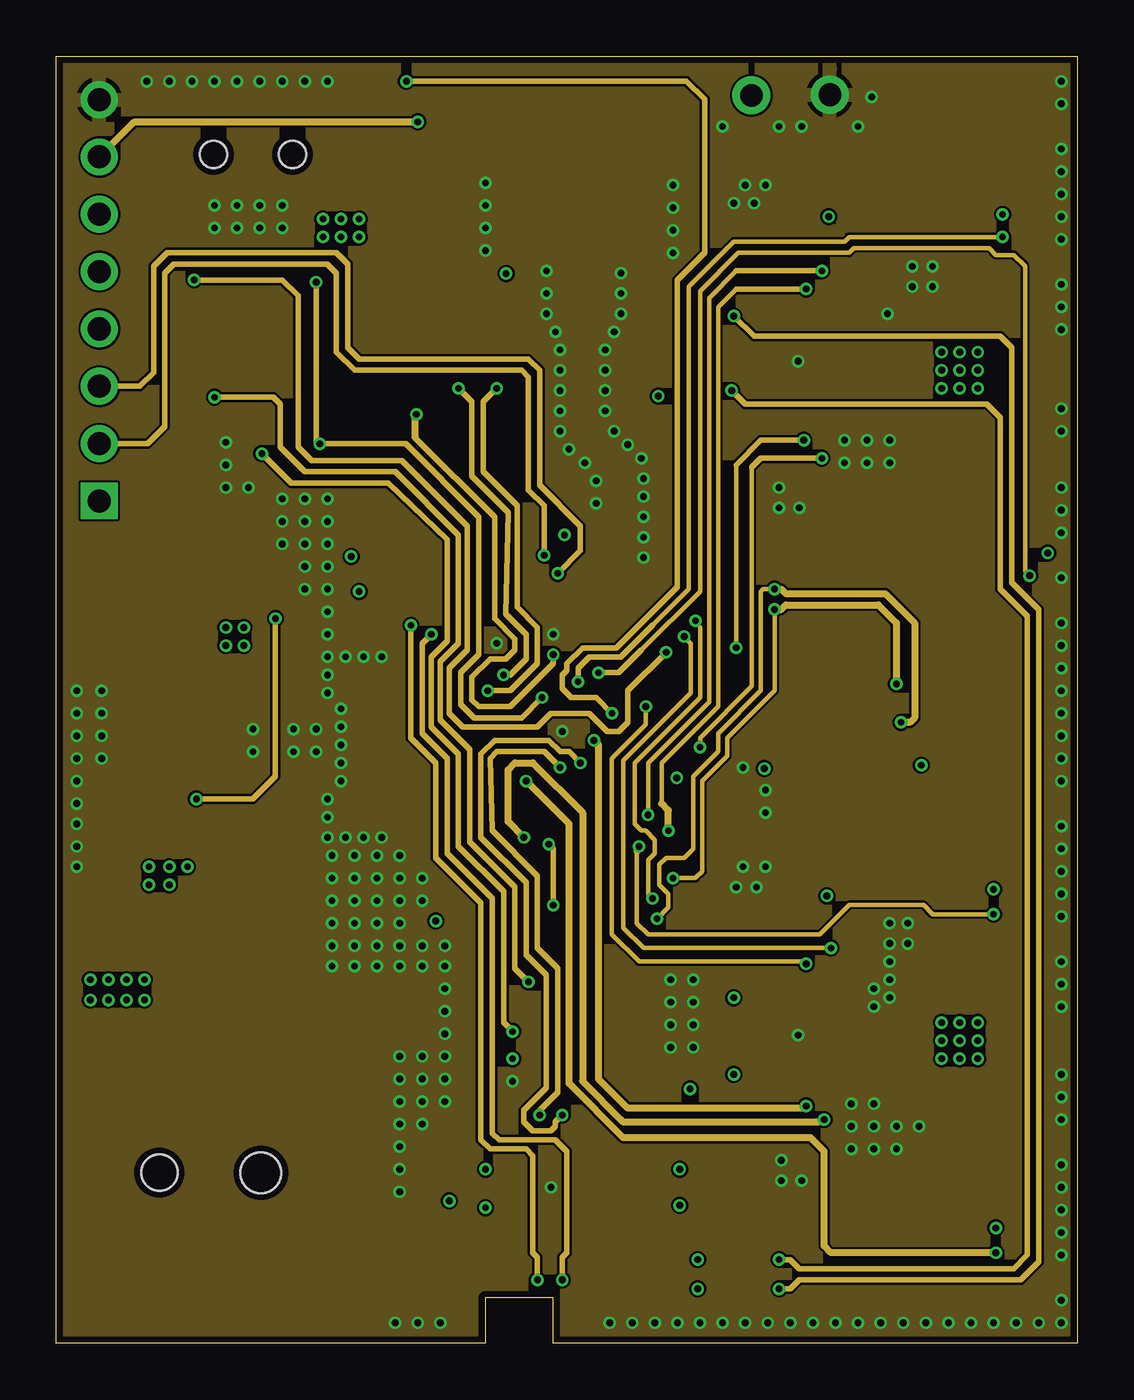
[diagram p9: board, inner layer Route2]
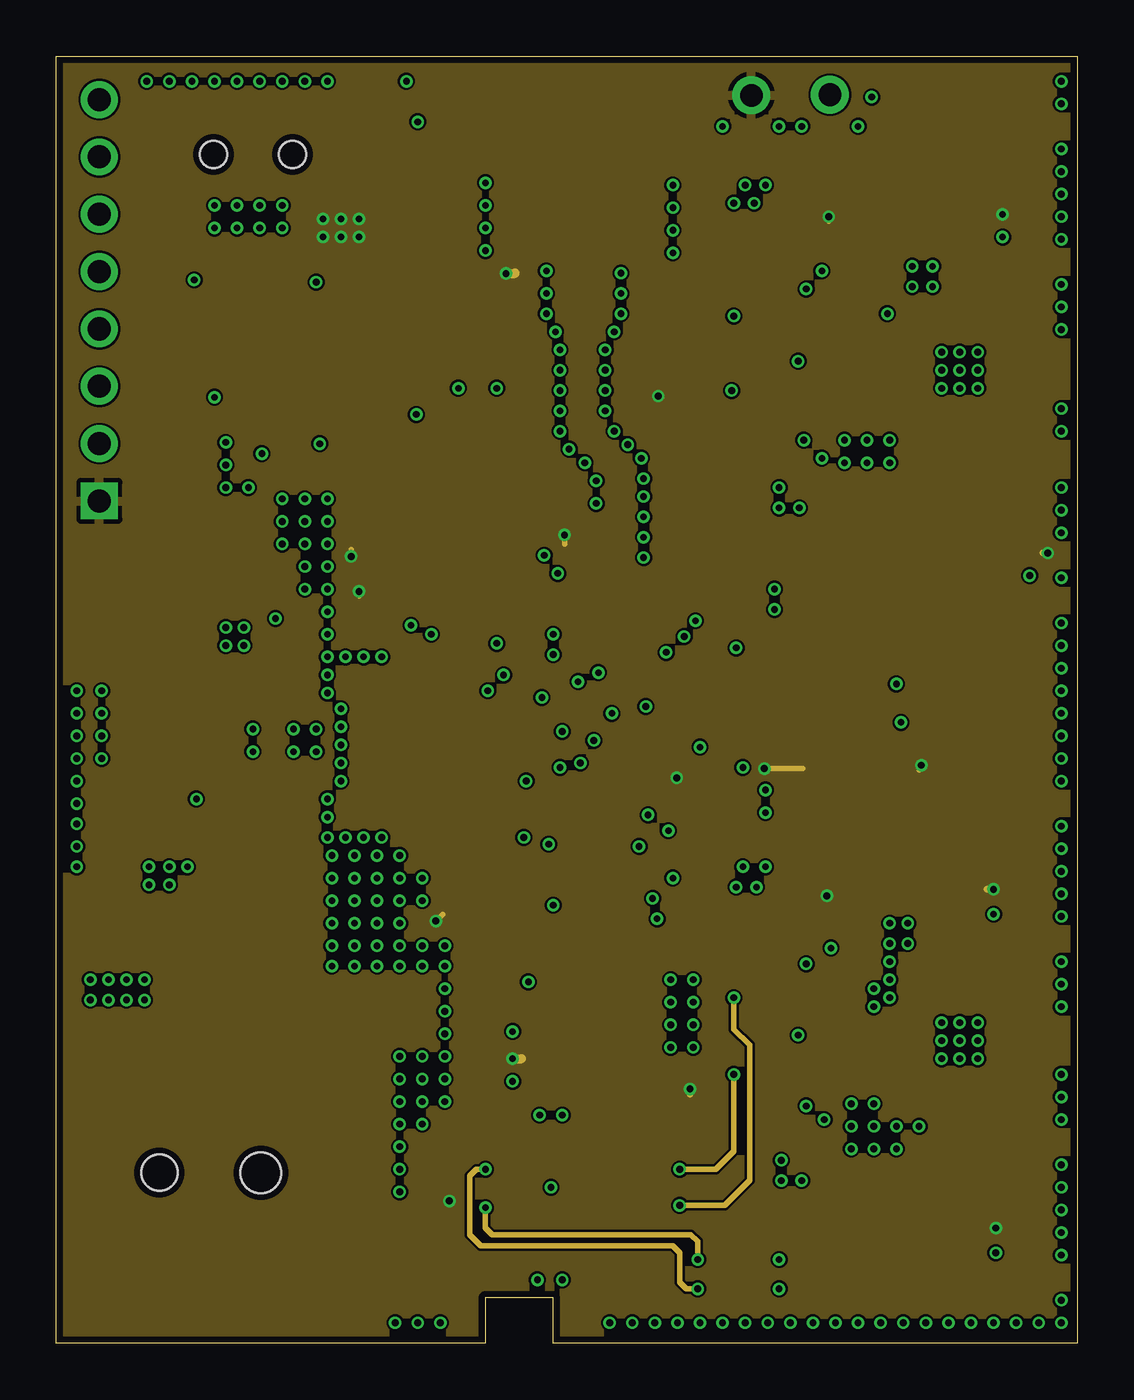
[diagram p10: board, inner layer Route15]
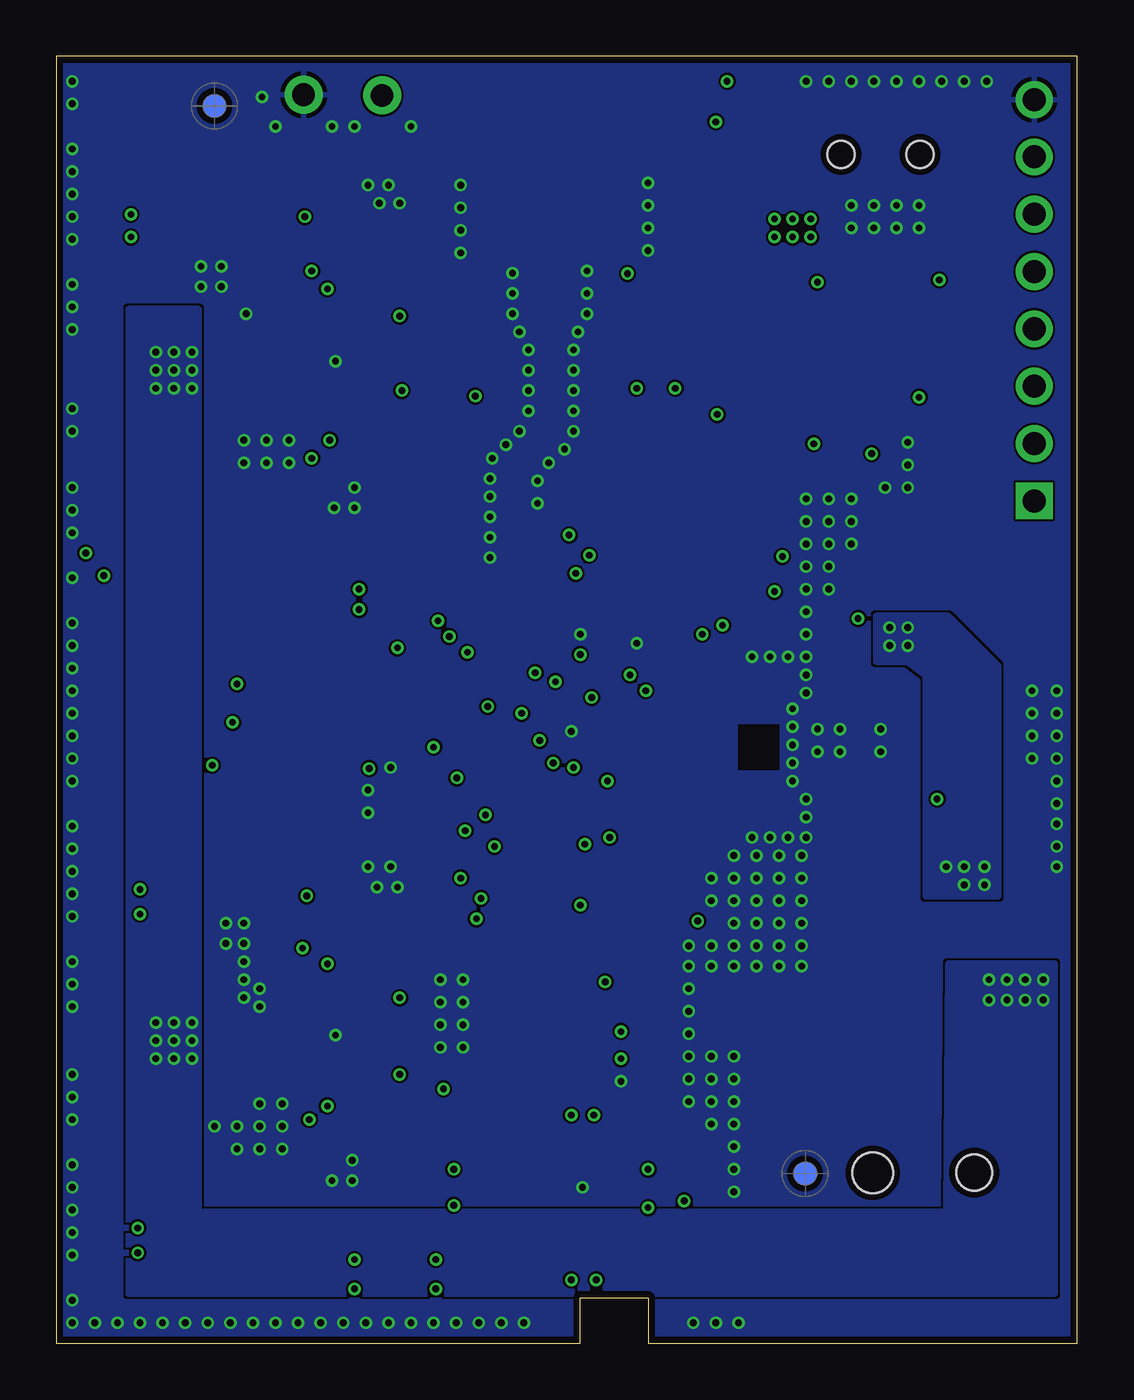
[diagram p11: board, bottom side, seen from below]

Size 45.2 x 57 mm. Coordinates in mm from the lower left corner, seen from the top.
Outline: 0,0 0,57 45.2,57 45.2,0 22,0 22,2 19,2 19,0 0,0
Copper layers (1*2*15*16): Top 0.035mm / dielectric 0.2mm / Route2 0.035mm / dielectric 1mm / Route15 0.035mm / dielectric 0.2mm / Bottom 0.035mm
Design rules "PCB HighSpec PTB": minimum track width 0.125mm, minimum drill 0.2mm, track to track 0.1mm, track to pad 0.1mm, pad to pad 0.1mm, via to via 0.1mm, smd to smd 0.1mm, copper to edge 0.3mm, drill to drill 0.2mm, minimum pad ring 0.2mm, minimum via ring 0.125mm, stop-mask expansion 0.075mm, vias tented up to drill 0.31mm, thermal gap 0.2mm
tKeepout: area 18,0 to 23,3

### Footprints (pad centres in the part's own frame; a part is rotated, then mirrored left to right if it is on the bottom)
1X01_ROUND = drill 1 pad 1.676: 1 0,0
C0402 = smd 0.7 x 0.9: 1 -0.65,0; 2 0.65,0
C0805 = smd 1.3 x 1.5: 1 -0.95,0; 2 0.95,0
C1210 = smd 1.6 x 2.7: 1 -1.4,0; 2 1.4,0
C0603 = smd 1.1 x 1: 1 -0.85,0; 2 0.85,0
DCJACK_2MM_SMT = smd 2.4 x 2: GND 0,-5.5; GNDBREAK 6.2,-5.5; PWR1 0,5.5; PWR2 6.2,5.5 | hole 1.6: 0,0 | hole 1.8: 4.5,0
MINIMELF = smd 1.4 x 1.8: A 1.7,0; C -1.7,0
PTC0805 = smd 1 x 1.5: 1 -1.1,0; 2 1.1,0
INTEGRATEDCIRCUITS_TQFP48-7X7 = smd 0.85 x 0.32: 1 -4.275,2.75; 2 -4.275,2.25; 3 -4.275,1.75; 4 -4.275,1.25; 5 -4.275,0.75; 6 -4.275,0.25; 7 -4.275,-0.25; 8 -4.275,-0.75; 9 -4.275,-1.25; 10 -4.275,-1.75; 11 -4.275,-2.25; 12 -4.275,-2.75; 25 4.275,-2.75; 26 4.275,-2.25; 27 4.275,-1.75; 28 4.275,-1.25; 29 4.275,-0.75; 30 4.275,-0.25; 31 4.275,0.25; 32 4.275,0.75; 33 4.275,1.25; 34 4.275,1.75; 35 4.275,2.25; 36 4.275,2.75 | smd 0.32 x 0.85: 13 -2.75,-4.275; 14 -2.25,-4.275; 15 -1.75,-4.275; 16 -1.25,-4.275; 17 -0.75,-4.275; 18 -0.25,-4.275; 19 0.25,-4.275; 20 0.75,-4.275; 21 1.25,-4.275; 22 1.75,-4.275; 23 2.25,-4.275; 24 2.75,-4.275; 37 2.75,4.275; 38 2.25,4.275; 39 1.75,4.275; 40 1.25,4.275; 41 0.75,4.275; 42 0.25,4.275; 43 -0.25,4.275; 44 -0.75,4.275; 45 -1.25,4.275; 46 -1.75,4.275; 47 -2.25,4.275; 48 -2.75,4.275
M1X8 = drill 1.02 pad 1.632 square: 1 -8.89,0 | drill 1.02 pad 1.632: 2 -6.35,0; 3 -3.81,0; 4 -1.27,0; 5 1.27,0; 6 3.81,0; 7 6.35,0; 8 8.89,0
L1812 = smd 2 x 3.5: 1 -1.6,0; 2 1.6,0
0805 = smd 1.2 x 1: 1 -1.1,0; 2 1.1,0
CHIPLED_0603 = smd 0.8 x 0.8: A 0,-0.75; C 0,0.75
LED3535 = smd 1 x 0.85: 1 -1.75,0.875; 2 -1.75,-0.875; 3 1.75,-0.875; 4 1.75,0.875
FCI_SFW5R-1STE1LF = smd 0.61 x 2.007: 1 2.007,2.743; 2 0.991,2.743; 3 0,2.743; 4 -0.991,2.743; 5 -2.007,2.743 | smd 0.711 x 4.191: 6 -2.997,4.877; 7 2.997,4.877
R0603 = smd 1 x 1.1: 1 -0.85,0; 2 0.85,0
R0402 = smd 0.7 x 0.9: 1 -0.65,0; 2 0.65,0
R0805 = smd 1.3 x 1.5: 1 -0.95,0; 2 0.95,0
TP11R = smd 1.1 x 1.1: TP 0,0
DFN400X400X100-9N = smd 0.711 x 0.406: 1 -1.956,1.194; 2 -1.956,0.406; 3 -1.956,-0.406; 4 -1.956,-1.194; 5 1.956,-1.194; 6 1.956,-0.406; 7 1.956,0.406; 8 1.956,1.194 | smd 2.21 x 2.997: 9 0,0
QFN65P400X400X80-17N = smd 0.965 x 0.381: 1 -1.905,0.965; 2 -1.905,0.33; 3 -1.905,-0.33; 4 -1.905,-0.965; 9 1.905,-0.965; 10 1.905,-0.33; 11 1.905,0.33; 12 1.905,0.965 | smd 0.381 x 0.965: 5 -0.965,-1.905; 6 -0.33,-1.905; 7 0.33,-1.905; 8 0.965,-1.905; 13 0.965,1.905; 14 0.33,1.905; 15 -0.33,1.905; 16 -0.965,1.905 | smd 2.108 x 2.108: 17 0,0
SOP65P640X110-16N = smd 1.473 x 0.356: 1 -2.921,2.286; 2 -2.921,1.626; 3 -2.921,0.965; 4 -2.921,0.33; 5 -2.921,-0.33; 6 -2.921,-0.965; 7 -2.921,-1.626; 8 -2.921,-2.286; 9 2.921,-2.286; 10 2.921,-1.626; 11 2.921,-0.965; 12 2.921,-0.33; 13 2.921,0.33; 14 2.921,0.965; 15 2.921,1.626; 16 2.921,2.286
LGA24-8X4 = smd 0.27 x 0.45: 1 -1.505,1.225; 6 -1.505,-1.225; 7 -1.075,-1.225; 8 -0.645,-1.225; 9 -0.215,-1.225; 10 0.215,-1.225; 11 0.645,-1.225; 12 1.075,-1.225; 13 1.505,-1.225; 18 1.505,1.225; 19 1.075,1.225; 20 0.645,1.225; 21 0.215,1.225; 22 -0.215,1.225; 23 -0.645,1.225; 24 -1.075,1.225 | smd 0.45 x 0.27: 2 -1.475,0.645; 3 -1.475,0.215; 4 -1.475,-0.215; 5 -1.475,-0.645; 14 1.475,-0.645; 15 1.475,-0.215; 16 1.475,0.215; 17 1.475,0.645
DLW5BTN501SQ2L = smd 1.3 x 1.7: 1 -1.1,1.5; 2 1.1,1.5; 3 -1.1,-1.5; 4 1.1,-1.5
SOT95P290X145-5N = smd 1.27 x 0.559: 1 -1.295,0.94; 2 -1.295,0; 3 -1.295,-0.94; 4 1.295,-0.94; 5 1.295,0.94
LUMBERG_1503-13-VP3 = smd 2.6 x 2: 1 4.75,0 | smd 2 x 2.6: 2 4.75,3.55; 3 4.75,-3.55; 4 -4.75,4; 4A -4.75,-4 | hole 1.2: -5.95,1.75; -5.95,-1.75
101X14N330MV4T_X2Y_0603 = smd 0.45 x 1: A -0.686,0; B 0.686,0 | smd 0.5 x 1: G 0,0
TSZ124IQ4T = smd 0.8 x 0.3: 1 -1.505,0.75; 2 -1.505,0.25; 3 -1.505,-0.25; 4 -1.505,-0.75; 9 1.505,-0.75; 10 1.505,-0.25; 11 1.505,0.25; 12 1.505,0.75 | smd 0.3 x 0.8: 5 -0.75,-1.505; 6 -0.25,-1.505; 7 0.25,-1.505; 8 0.75,-1.505; 13 0.75,1.505; 14 0.25,1.505; 15 -0.25,1.505; 16 -0.75,1.505 | smd 1.5 x 1.5: 17 0,0
CONN_USB_MICRO-B = smd 1.6 x 1.4: BODY@1 -3.2,2.45; BODY@2 3.2,2.45 | smd 1.45 x 1.3: BODY@3 3.425,0; BODY@6 -3.425,0 | smd 1.9 x 1.9: BODY@4 1.2,0; BODY@5 -1.2,0 | smd 0.4 x 1.35: P1 -1.3,2.675; P2 -0.65,2.675; P3 0,2.675; P4 0.65,2.675; P5 1.3,2.675
RESONATOR_EPSON_FC_145 = smd 1.1 x 1.8: P$1 -1.55,0; P$2 1.55,0
CT/CN0603 = smd 1 x 1: 1 -1,0; 2 1,0

### Placement (x,y rotation side)
3.3V  30.78,55.27 0 top
C1  29.43,23.13 45 top
C2  3.5,23.7 180 top
C3  36.85,19.99 180 top
C4  1.8,18.3 90 top
C5  36.81,49.9 180 top
C6  36.72,34.78 180 top
C7  9.83,29.77 270 top
C8  16.28,50.3 0 top
C9  3.59,22.14 180 top
C10  9,15.2 0 top
C11  13.7,35.9 0 top
C12  5.28,38.14 90 top
C13  36.3,4.67 180 top
C14  38.02,44.7 90 top
C15  35.5,47.58 90 top
C16  38,41.6 270 top
C17  38.01,15.13 90 top
C18  35.39,17.7 90 top
C19  38.05,11.99 270 top
C20  16.2,52.3 0 top
C21  27.98,9.54 270 top
C22  43,13.4 0 top
C23  16.91,33.95 135 top
C24  26.77,24.27 315 top
C25  17.9,21.9 225 top
C26  13.5,29.4 0 top
C27  13.5,23.4 0 top
C28  16,33.2 135 top
C29  23.6,35.1 270 top
C30  17.7,37.4 90 top
C31  16.4,23.8 225 top
C32  17.1,22.8 225 top
C33  43,43.2 0 top
C34  10.1,23.4 270 top
C35  17.4,7.2 180 top
C36  36.6,2.8 180 top
C37  36.8,47.5 270 top
C38  37.7,32.3 270 top
C40  22,48.5 180 top
C41  24.5,48.5 0 top
C48  32.9,24.8 270 top
C50  37.3,25 270 top
C51  36.2,25 270 top
C52  31.2,26.7 180 top
C53  34.7,24.4 270 top
CN1  4.55,7.55 0 top
D1  20.8,37.4 180 top
F2  7.1,22.4 180 top
F3  4.4,17.6 180 top
GND  34.25,55.3 0 top
IC2  21.5,28.4 45 top
J1  1.9,46.2 90 top
L1  3.93,32.34 180 top
L2  18.4,20.3 225 top
LED1  27.8,46.1 0 top
LED2  15.6,55 0 top
M1  37,51 270 top
M2  37,36 270 top
M3  37,21 270 top
M4  37,6 270 top
R1  7.86,35.76 90 top
R2  8.76,33.46 180 top
R3  32.36,31.46 0 top
R4  32.91,48.97 270 top
R5  33.02,18.96 270 top
R6  36.6,32.3 90 top
R7  28.2,20.7 90 top
R8  23.7,19.4 180 top
R9  20.4,14.9 0 top
R10  27.8,42.8 270 top
R13  20.8,39 0 top
R14  30.6,18 270 top
R15  20.1,35.7 180 top
R16  32.27,34.43 0 top
R17  30.6,8.8 90 top
R19  30.6,48.3 270 top
R21  22.7,46.7 270 top
R22  23.9,46.7 270 top
R23  35.5,32.3 90 top
R24  34.2,32.3 90 top
R25  38.3,29.2 270 top
R26  30.6,38.8 90 top
R28  17.9,34.7 315 top
R29  30.2,3.7 0 top
R37  30.2,2.4 0 top
R39  26,6.1 0 top
R42  25.5,3.8 0 top
R46  26,7.7 0 top
R47  18.7,10.1 180 top
R48  20.7,3.8 180 top
R49  23,3.8 0 top
R50  24.5,10.1 0 top
R56  25.8,9 0 top
R57  17.4,8.4 180 top
R58  18.2,3.8 180 top
TP1  17.33,41.16 0 top
TP2  17.33,43.7 0 top
TP3  17.32,46.25 0 top
TP4  19.88,41.15 0 top
TP5  19.88,43.7 0 top
TP6  19.88,46.25 0 top
U1  5.8,27.22 90 top
U2  32.84,43.5 0 top
U3  32.84,13.64 0 top
U4  24.7,14.5 270 top
U5  34.4,28.7 180 top
U$1  [FIDUCIAL_G10]  12.04,7.51 270 bottom
U$2  [FIDUCIAL_G10]  37.11,54.1 270 top
U$3  [FIDUCIAL_G10]  38.21,54.8 270 bottom
U$4  [FIDUCIAL_G10]  15.64,14.51 270 top
U$5  9,18.7 90 top
U$6  14,38.6 270 top
U$7  8.7,46.7 270 top
U$8  37.2,36.7 90 top
U$9  37.2,21.7 90 top
U$10  37.2,6.7 90 top
U$15  21.9,6.9 0 top
U$19  37.2,51.7 90 top
USB1  22.97,55.43 180 top
Y1  14.1,26.4 90 top
Z1  21.7,49.7 0 top
Z2  24.9,49.7 180 top
Z3  16.3,49 180 top
Z4  14.1,45.2 180 top
Z5  14.1,43.9 180 top

### Tracks (layer width: path | path; a pad name or v marks a point on that pad's centre or on a via)
12VFUSED  (via drill 0.3)
  other vias: 4.1,21.1 5,21.1 5.8,21.1 4.1,20.3 5,20.3 7.5,31.7 8.3,31.7 8.3,30.9 7.5,30.9
  pour Top (no thermals): 6.7,23.7 6.7,19.8 3.5,19.8 3.5,25.9 5.9,25.9 5.9,23.7
  pour Bottom: 5.7,32.2 8.9,32.2 8.9,30.2 7.5,30.2 6.7,29.6 6.7,19.8 3.5,19.8 3.5,30
  pour Top (no thermals): 6.6,28.5 5.9,28.5 5.9,29.9 6.2,30.2 6.7,30.2 7,30.5 7,32.2 10.8,32.2 10.8,29.8 6.6,29.8
+3V3  (via drill 0.3)
  Top 0.254: R13.2 22.1,39 22.5,38.6 D1.C | D1.C 22.2,37.3 | 36.7,32.9 36.6,33 R6.2 36.6,33.8 36.8,34 37.4,34 37.5,34.1 37.5,34.7 | 37.3,35 M2.2 | U5.3 37.48,28.48 37.6,28.6 38.25,28.6 R25.2 38.25,28.5 38.3,28.5 38.4,28.4 38.4,25.7 v38.3,25.6 | U5.1 35.91,27 36.1,26.8 37,26.8 37.3,26.5 C50.1 37.15,25.6 v38.3,25.6 | U5.23 35.05,26.55 34.7,26.2 C53.1 34.6,25.5 34.55,25.45 C48.1 | U5.22 34.62,26.82 34.1,26.3 33.1,26.3 32.9,26.1 C48.1 | C48.1 v31.35,25.45 | 38.35,25.65 v38.3,25.6 | R5.1 v34.12,19.82 | D1.C v22.5,35.8 22.5,35 22.9,34.6 23.45,34.6 C29.2 23.5,34.29 IC2.36 | IC2.17 24.74,24.1 25.7,24.1 26.13,24.53 C24.1 | IC2.44 17.4,31.44 17.4,31.9 16.6,32.7 16.5,32.7 16.24,32.6 16.4,32.6 16.36,32.64 | 16.36,32.64 16.22,32.5 15.4,32.5 14.6,33.3 v13.4,33.3 | 16.36,32.64 C28.1 | L2.2 17.54,19.5 17.5,19.4 v16.8,18.7 | U$6.4 13.05,37.22 C11.1 v13.05,34.85 | R1.2 5.65,36.6 5.1,36.8 | U$7.4A U$7.4 12.75,51.4 15.3,51.4 15.55,51.65 C20.1 15.6,52.35 15.6,53.2 15.4,53.4 14,53.4 13.85,53.55 LED2.2 | R4.1 33,49.9 v34.2,49.9 | U$15.2 19.55,7.15 19.4,7 18.25,7 C35.1 18.1,7.15 18.1,6.5 17.8,6.3 v17.4,6.3 | R10.2 v26.65,41.95
  Top 0.305: M4.2 39.83,5.1 v41.6,5.1 | M3.2 39.83,20.1 v41.5,20.1 | M2.2 39.75,35 v43.9,35 | M1.2 39.75,50 v41.9,50 | R3.2 32.92,31.57 32.92,32.9 | 32.92,32.9 R16.2 32.8,34.45 | 32.92,32.9 34.15,32.9 R24.2 R23.2 R6.2 | v28.06,11.26 28.06,10.29 28.19,10.12 C21.1 27.31,10.19 27,10.5 27,11.2 26.99,10.62 U4.16 | C24.1 26.62,25.04 v27.47,25.04
  Top 0.406: M4.2 37.59,5.01 C13.1 | M3.2 37.72,20.01 C3.1 | 37.3,35 37.29,34.9 C6.1 37.27,34.58 37.5,34.7 | M1.2 37.77,50.01 C5.1 | TP6.TP 19.91,46.25 v19.91,47.38 | R9.1 19.3,14.9 19,14.6 19,13 19.4,12.6 v20.2,12.6
  Route15 0.254: v31.35,25.45 33.05,25.45 | v38.3,25.6 38.2,25.4 | v34.12,19.82 34.02,19.82 34,19.8 | v22.5,35.8 22.5,35.4 | v27.47,25.04 27.58,25.04 | v13.4,33.3 13.4,33.1 | v16.8,18.7 17.1,19 | v13.05,34.85 13.05,35.15 13,34.9 | v34.2,49.9 34.2,49.7 | v17.4,6.3 17.4,6.4 | v26.65,41.95 26.75,41.95 26.8,41.9
  Route15 0.305: v41.6,5.1 41.7,5.1 | v41.5,20.1 41.2,20.1 | v43.9,35 43.7,35 | v28.06,11.26 28.06,11.02
  Route15 0.406: v19.91,47.38 20.3,47.38 20.3,47.4 | v20.2,12.6 20.6,12.6
  other vias: 11.8,49.8 12.6,49.8 13.4,49.8 13.4,49 12.6,49 11.8,49
  pour Route15: 0,0 0,57 46,57 46,0
  pour Top: 3.7,30 1,30 1,38.4 6.9,38.3 6.9,34.9 3.7,35
  pour Top: 14.4,52.7 10.7,52.7 10.7,48.3 16.2,48.3 16.2,51 14.4,51
+12V  (via drill 0.3)
  other vias: 39.2,14.2 40,14.2 40.8,14.2 40,13.4 39.2,13.4 40.8,13.4 40.8,12.6 40,12.6 39.2,12.6 39.2,43.9 40,43.9 40.8,43.9 39.2,43.1 40,43.1 40.8,43.1 39.2,42.3 40,42.3 40.8,42.3 3.9,15.2 3.9,16.1 2.3,16.1 1.5,15.2 3.1,15.2 3.1,16.1 2.3,15.2 1.5,16.1
  pour Bottom: 1,2.2 1,16.8 5.7,16.8 5.8,5.8 38.9,5.8 38.9,45.8 42,45.8 42,2.2
  pour Top (no thermals): 34.1,13.7 34.1,13 35.9,13 36.6,12.3 42,12.3 42,14.4 36.7,14.4 36,13.7 34.5,13.7
  pour Top (no thermals): 34.1,43.5 34.1,42.8 35.9,42.8 36.6,42.1 42,42.1 42,44.2 36.7,44.2 36,43.5 34.5,43.5
  pour Top (no thermals): 4.4,18.4 4.4,14.7 1,14.7 1,18.4
BROKENOUT  (via drill 0.3)
  Top 0.254: IC2.26 26.88,30.6 v27,30.6 | v6.1,47.1 6.1,48.6 4.69,50.01 J1.6
  Route2 0.254: v27,30.6 25.3,28.9 25.3,27.5 24.9,27.1 24.4,27.1 23.6,27.9 21.9,27.9 21.3,27.3 18,27.3 17.4,27.9 17.4,29.9 18.2,30.7 18.2,36.2 15.3,39.1 11.3,39.1 10.7,39.7 10.7,46.4 10,47.1 v6.1,47.1
C1
  Top 0.254: U5.24 35.48,26.82 36.2,26.1 C51.1
CAP
  Top 0.254: U5.21 34.19,26.98 33.9,26.7 C52.1
COMMS_SWITCH  (via drill 0.3)
  Top 0.203: IC2.30 25.45,32 v28.3,32
  Top 0.254: v26.4,19.7 25.4,19.7 25.03,19.33 U4.4 25.03,15.33 24.6,14.9 R9.2
  Route2 0.203: v26.4,19.7 26.2,19.9 26.2,21.4 26.5,21.7 26.5,22.3 26.1,22.7 25.9,22.7 25.6,23 25.6,25.7 28.5,28.6 28.5,31.7 v28.3,32
D+
  Top 0.305: R21.2 22.7,45.2 23,44.9 23,40.3 24.6,38.7 24.6,33.98 IC2.34
D-
  Top 0.305: R22.2 23.9,45.2 23.6,44.9 23.6,40.5 25.2,38.9 25.2,33.87 IC2.33
EMG_ADC_0
  Top 0.254: IC2.10 19.3,23.73 19.3,22.3 20.3,21.3 27.8,21.3 R7.2
EMG_ADC_1  (via drill 0.3)
  Top 0.254: IC2.11 20.48,24.2 21,24.2 21.2,24 21.2,23.1 21.8,22.5 v21.8,22.1 | v22,19.4 R8.2
  Route2 0.254: v21.8,22.1 22,21.9 v22,19.4
GND  (via drill 0.3)
  Top 0.254: U5.20 U5.19 U5.18 32.9,27.82 U5.17 U5.16 U5.15 U5.14 32.45,29.34 | IC2.5 18.84,26.7 20.5,26.7 | IC2.35 22.3,32.38 22.3,31.7 | IC2.18 24.85,24.7 25.2,24.7 26.2,25.7 26.9,25.7 | IC2.42 19.25,31 v19.5,31 | U$15.3 21.65,6.65 U$15.17
  Top 0.305: U2.11 35.53,43.83 36.5,44.8
  Top 0.406: U3.11 35.27,13.97 v36.2,14.9
  other vias: 36.9,16.1 36.9,15.3 36.2,15.7 36.9,16.9 36.9,17.7 37.7,17.7 36.9,18.6 37.7,18.6 21.7,47.5 21.7,46.5 21.7,45.6 22.1,44.8 22.3,44 22.3,43.1 22.3,42.2 22.3,41.3 22.3,40.4 22.7,39.6 23.4,39 23.9,38.2 23.9,37.2 26,34.8 26,35.7 26,36.6 26,37.5 26,38.3 25.9,39.2 25.3,39.8 24.7,40.4 24.3,41.3 24.3,42.2 24.3,43.1 24.3,44 24.7,44.8 25,45.6 25,46.5 25,47.4 36.8,45.6 37.9,46.8 37.9,47.7 38.8,46.8 38.8,47.7 32,37.9 32,37 32.9,37 30,50.5 30.9,50.5 30.5,51.3 31.4,51.3 32.1,8.1 32.1,7.2 33,7.2 30.1,20.2 30.4,21.1 31,20.2 31.4,21.1 13.6,30.4 12.8,30.4 12,30.4 12,29.6 12,28.8 14.4,30.4 12.6,28.1 12.6,27.3 12.6,26.5 12.6,25.7 12.6,24.9 12,24.1 12,23.3 12,22.4 12.8,22.4 13.6,22.4 14.4,22.4 0.9,23.9 0.9,24.9 0.9,25.9 0.9,26.9 0.9,27.9 0.9,28.9 0.9,23 2,25.9 2,26.9 2,27.9 2,28.9 22,31.4 32.84,43.5 32.84,13.64 14.2,16.7 13.2,16.7 12.2,16.7 14.2,17.6 13.2,17.6 12.2,17.6 22.4,27.1 21.9,6.9 29.5,53.9 32,53.9 33,53.9 35.5,53.9 36.1,55.2 44.5,55.9 44.5,54.9 44.5,52.9 44.5,51.9 44.5,50.9 44.5,49.9 44.5,48.9 44.5,46.9 44.5,45.9 44.5,44.9 44.5,41.4 44.5,40.4 44.5,37.9 44.5,36.9 44.5,35.9 44.5,33.9 44.5,31.9 44.5,30.9 44.5,29.9 44.5,28.9 44.5,27.9 44.5,26.9 44.5,25.9 44.5,24.9 44.5,22.9 44.5,21.9 44.5,20.9 44.5,19.9 44.5,18.9 44.5,16.9 44.5,15.9 44.5,14.9 44.5,11.9 44.5,10.9 44.5,9.9 44.5,7.9 44.5,6.9 44.5,5.9 44.5,4.9 44.5,3.9 44.5,1.9 44.5,0.9 43.5,0.9 42.5,0.9 41.5,0.9 40.5,0.9 39.5,0.9 38.5,0.9 37.5,0.9 36.5,0.9 35.5,0.9 34.5,0.9 33.5,0.9 32.5,0.9 31.5,0.9 30.5,0.9 29.5,0.9 28.5,0.9 27.5,0.9 26.5,0.9 25.5,0.9 24.5,0.9 17,0.9 16,0.9 15,0.9 12.2,18.6 12.2,19.6 12.2,20.6 12.2,21.6 13.2,18.6 13.2,19.6 13.2,20.6 13.2,21.6 14.2,18.6 14.2,19.6 14.2,20.6 14.2,21.6 12,31.4 12,32.4 12,33.4 11,33.4 11,34.4 11,35.4 11,36.4 11,37.4 12,37.4 12,36.4 12,35.4 12,34.4 7.5,39.9 7.5,38.9 7.5,37.9 8.5,37.9 10,37.4 10,36.4 10,35.4 4,55.9 5,55.9 6,55.9 7,55.9 8,55.9 9,55.9 10,55.9 11,55.9 12,55.9 19,51.4 19,50.4 19,49.4 19,48.4 27.3,51.3 27.3,50.3 27.3,49.3 27.3,48.3 8.7,27.2 8.7,26.2 10.5,27.2 10.5,26.2 11.5,27.2 11.5,26.2 0.9,22 0.9,21.1 7,50.4 8,50.4 9,50.4 10,50.4 10,49.4 9,49.4 8,49.4 7,49.4 15.2,16.7 16.2,16.7 17.2,16.7 15.2,17.6 16.2,17.6 17.2,17.6 17.2,15.7 17.2,14.7 17.2,13.7 17.2,12.7 16.2,12.7 15.2,12.7 15.2,11.7 16.2,11.7 17.2,11.7 15.2,10.7 16.2,10.7 17.2,10.7 15.2,9.7 16.2,9.7 15.2,8.7 15.2,7.7 15.2,6.7 34.9,40 35.9,40 36.9,40 36.9,39 35.9,39 34.9,39 30.4,25.5 31.4,24.5 31.4,23.5 15.2,18.6 15.2,19.6 16.2,19.6 16.2,20.6 15.2,20.6 15.2,21.6 20.2,11.6 28.2,16.1 28.2,15.1 28.2,14.1 28.2,13.1 27.2,16.1 27.2,15.1 27.2,14.1 27.2,13.1 35.2,10.6 36.2,10.6 36.2,9.6 35.2,9.6 35.2,8.6 36.2,8.6 37.2,9.6 37.2,8.6 38.2,9.6
  pour Top (rank 4): 0,57 46,57 47,0 14.6,-0.1 14.4,-0.1 -0.1,-0.2
  pour Bottom (rank 2): 0,0 -1,57 45,57 46,0
  pour Route2: 0,0 0,57 46,57 46,0
M1-ISENSE  (via drill 0.3)
  Top 0.254: U2.1 30.23,44.47 30,44.7 v30,45.5 | v32,2.4 R37.2
  Top 0.406: U2.1 30.94,47.01 R19.2
  Route2 0.254: v30,45.5 30.9,44.6 41.8,44.6 42.3,44.1 42.3,33.7 43.5,32.5 43.5,3.6 42.7,2.8 32.9,2.8 32.5,2.4 v32,2.4
M1-ISENSE-OUT  (via drill 0.3)
  Top 0.254: IC2.15 22.3,25.12 v22.3,25.5 | U$15.15 21.65,9.85 v21.4,10.1 R47.1
  Route2 0.254: v22.3,25.5 21.6,26.2 19.5,26.2 19.2,25.9 19.3,22.7 21.3,20.7 21.3,17.5 22.2,16.6 22.2,11.1 21.4,10.3 v21.4,10.1
M2-ISENSE  (via drill 0.3)
  Top 0.254: U2.4 30.23,42.53 v29.9,42.2 | v32,3.7 R29.2
  Top 0.305: R26.2 30.6,42.49 U2.4
  Top 0.406: 30.94,40.09 R26.2
  Route2 0.254: v29.9,42.2 30.5,41.6 41.2,41.6 41.8,41 41.8,33.4 43,32.2 43,3.9 42.4,3.3 32.9,3.3 32.5,3.7 v32,3.7
M2-ISENSE-OUT  (via drill 0.3)
  Top 0.254: IC2.48 15.7,30.31 v15.7,31.8 | U$15.6 21.65,4.65 21.35,4.35 R48.1 21.3,3.65 v21.3,2.8
  Route2 0.254: v15.7,31.8 15.7,26.8 16.8,25.7 16.8,21.5 18.8,19.5 18.8,9 19.2,8.6 20.8,8.6 21.1,8.3 21.1,4 21.3,3.8 v21.3,2.8
M3-ISENSE  (via drill 0.3)
  Top 0.254: U3.1 30.19,14.61 30,14.8 v30,15.3 | v27.6,6.1 R39.2
  Top 0.406: U3.1 30.94,17.31 R14.2
  Route15 0.254: v30,15.3 30,13.9 30.7,13.2 30.7,7.2 29.6,6.1 v27.6,6.1
M3-ISENSE-OUT  (via drill 0.3)
  Top 0.254: U$15.7 22.15,3.75 22.2,3.7 R49.1 22.4,3.75 v22.4,2.8
  Top 0.305: IC2.47 16.5,30.22 16.5,31.3 v16.6,31.4
  Route2 0.254: v16.6,31.4 16.2,31 16.2,27 17.3,25.9 17.3,21.7 19.3,19.7 19.3,9.3 19.6,9 22.1,9 22.6,8.5 22.6,4 22.4,3.8 v22.4,2.8
M4-ISENSE  (via drill 0.3)
  Top 0.254: U3.4 30.18,12.68 30,12.5 v30,11.9 | v27.6,7.7 R46.2
  Top 0.305: 30.94,10.09 U3.4
  Top 0.406: 30.94,10.09 R17.2
  Route15 0.254: v30,11.9 30,8.5 29.2,7.7 v27.6,7.7
M4-ISENSE-OUT  (via drill 0.3)
  Top 0.254: IC2.16 23.2,24.93 v23.2,25.7 | U$15.14 22.15,9.85 v22.4,10.1 R50.1
  Route2 0.254: v23.2,25.7 22.7,26.2 22.3,26.2 21.8,26.7 19.4,26.7 18.8,26.1 18.8,22.4 20.8,20.4 20.8,17.2 21.7,16.3 21.7,11.3 20.7,10.3 20.7,9.8 21.1,9.4 21.9,9.4 22.1,9.6 22.1,9.8 v22.4,10.1
MOTOR1_CLOSE  (via drill 0.3)
  Top 0.305: IC2.14 23.32,23.4 v26.2,23.4 | v33.9,47.5 33.9,46.3 33.8,46.2 U2.13
  Route2 0.203: v26.2,23.4 26.2,25.7 28.9,28.4 28.9,46.3 30.1,47.5
  Route2 0.254: 30.1,47.5 v33.9,47.5
MOTOR1_OPEN  (via drill 0.3)
  Top 0.305: IC2.13 23.31,22.7 v27.1,22.7 | 33.2,46.6 v33.2,46.7 33.17,46.67 U2.14
  Route2 0.203: 26.8,23.9 26.8,25.7 29.3,28.2 29.3,45.9 30.1,46.7
  Route2 0.254: 30.1,46.7 v33.2,46.7
  Route2 0.305: v27.1,22.7 27.1,23.6 26.8,23.9
MOTOR1_SENSE  (via drill 0.3)
  Top 0.254: C37.1 36.8,48.8 37,49 M1.1
  Top 0.305: M1.1 v41.89,48.99 v41.9,49 | IC2.3 17.82,27.2 17.8,27.2 18.3,27.7 21.7,27.7 22.3,28.4 22.3,29 22.6,29.3 v23.1,29.3
  Route2 0.203: v41.9,49 35.1,49 34.9,48.8 30,48.8 28,46.8 28,33.4 26.4,31.8
  Route2 0.254: 26.4,31.8 25,30.4 23.6,30.4 23.1,29.9 v23.1,29.3
MOTOR2_CLOSE  (via drill 0.3)
  Top 0.203: IC2.27 25.4,29.82 25.4,29.4 26,28.8 26.6,28.8 28.5,26.9 v28.5,26.4
  Top 0.254: v28.5,26.4 28.4,26.5
  Top 0.305: 28.4,26.5 28.5,26.5 v28.5,26.4 | U2.8 33.81,40.39 33.9,40.3 v33.9,39.2
  Route2 0.203: v28.5,26.4 28.5,26.8 30.8,29.1 30.8,38.8
  Route2 0.254: 30.8,38.8 31.2,39.2 v33.9,39.2
MOTOR2_OPEN  (via drill 0.3)
  Top 0.203: IC2.25 26.89,29.9 29.7,29.9 30.1,30.3 v30.1,30.8
  Top 0.305: U2.7 33.17,40.08 v33.1,40
  Route2 0.203: v30.1,30.8 30.1,38.9
  Route2 0.254: 30.1,38.9 31.2,40 v33.1,40
MOTOR2_SENSE  (via drill 0.3)
  Top 0.254: M2.1 38.09,33.99 37.7,33.6 C38.1
  Top 0.305: M2.1 42.99,33.99 v43.1,34 | IC2.7 19.65,26.2 22.6,26.2 23.1,26.7 23.1,28.2 24,29.1 v24,29.7
  Route2 0.203: v43.1,34 42.9,34.2 42.9,47.7 42.4,48.2 41.6,48.2 41.3,48.5 35.3,48.5 35.1,48.3 30.2,48.3 28.5,46.6 28.5,33.3 25.9,30.7
  Route2 0.254: 25.9,30.7 24.9,29.7 v24,29.7
MOTOR3_CLOSE  (via drill 0.3)
  Top 0.254: IC2.28 26.17,31.3 v27.8,31.3
  Top 0.305: U3.13 33.81,16.31 34.3,16.8 v34.3,17.5
  Route2 0.203: v27.8,31.3 28.1,31 28.1,28.8 25.1,25.8 25.1,18.4 26,17.5 v34.3,17.5
MOTOR3_OPEN  (via drill 0.3)
  Top 0.203: IC2.24 25.99,27.8 v26.1,28.2
  Top 0.305: U3.14 33.17,16.88 v33.2,16.8
  Route2 0.203: v26.1,28.2 26.1,27.4 24.6,25.9 24.6,18.1 25.8,16.9 33.2,16.9
  Route2 0.305: 33.2,16.9 v33.2,16.8
MOTOR3_SENSE  (via drill 0.3)
  Top 0.254: C1.1 28.4,22.1 27.7,22.1 27.6,22 v25.8,22
  Top 0.305: M3.1 41.39,18.99 v41.5,19 | v25.8,22 23.1,22 21.8,23.3 21.8,25 21.1,25.7 19.9,25.7 19.05,24.85 IC2.8
  Route2 0.203: v41.5,19 38.8,19 38.4,19.4 35.1,19.4 33.8,18.1 26.2,18.1 25.7,18.6 25.7,21.8
  Route2 0.305: 25.7,21.8 v25.8,22
MOTOR4_CLOSE  (via drill 0.3)
  Top 0.203: IC2.12 20.05,23.06 20.05,23.05 v20.7,22.4
  Top 0.305: U3.8 33.81,10.99 34,10.8 v34,9.9
  Route2 0.305: v20.7,22.4 20,23.1 20,25.4 20.3,25.7 21.1,25.7 23.3,23.5 23.3,11.6 25,9.9 25.08,9.81 33.71,9.81 v34,9.9
MOTOR4_OPEN  (via drill 0.3)
  Top 0.305: IC2.29 24.7,30.54 24.7,29 23.8,28.1 v23.8,26.7 | v33.2,10.5 33.17,10.57 U3.7
  Route2 0.305: v23.8,26.7 24,26.5 24,11.7 25.27,10.43 33.21,10.42 v33.19,10.5 v33.2,10.5
MOTOR4_SENSE  (via drill 0.3)
  Top 0.254: M4.1 38.59,3.99 38.3,3.7 38.3,3.1 38,2.8 C36.1
  Top 0.305: M4.1 v41.59,3.99 v41.6,4 | IC2.9 20.07,25.2 20.5,25.2 v20.8,24.9
  Route2 0.305: v41.6,4 34.3,4 34,4.3 34,8.5 33.4,9.1 25.1,9.1 22.7,11.5 22.7,23 v20.8,24.9
N$2
  Top 0.254: LED1.A R10.1
N$3
  pour Top (rank 2, no thermals): 5.8,28.5 5,28.5 5,30 4.7,30.3 4.2,30.3 4.1,30.4 4.1,34.1 4.4,34.4 6.6,34.4 6.9,34.1 6.9,30.6 6.6,30.3 6.1,30.3 5.8,30
N$5
  pour Top (rank 2, no thermals): 6.2,16.7 4.7,16.7 4.7,19.1 5.1,19.5 6.1,19.5 6.3,19.7 6.3,20.7 6.6,21 7,21 7.3,21.3 7.3,24.5 8.5,24.5 9.1,25.1 11,25.1 11,23.5 9.5,23.5 9,23 9,18.9 8.8,18.7 6.7,18.7 6.2,18.2
N$6  (via drill 0.3)
  Top 0.254: U1.3 6.21,24.29 v6.2,24.1 | R1.1 7.9,34.87 7.9,33.5 7.77,33.21 R2.2 7.9,33.37 7.9,32.8 8.1,32.6 9.4,32.6 9.7,32.37 v9.7,32.1
  Route2 0.254: v9.7,32.1 9.7,25.1 8.7,24.1 v6.2,24.1
N$7  (via drill 0.3)
  Top 0.254: R37.1 v28.4,2.4 | U$15.1 19.05,7.65 v19,7.7
  Route15 0.254: v28.4,2.4 27.9,2.4 27.6,2.7 27.6,4 27.3,4.3 18.8,4.3 18.3,4.8 18.3,7.4 18.6,7.7 v19,7.7
N$8
  Top 0.305: U2.9 35.47,42.53 37.2,40.8 37.95,40.8 C16.2
N$11  (via drill 0.3)
  Top 0.254: v20.9,16 23.4,16 23.73,16.34 U4.6 | v7,41.9 5.6,41.9 5.15,41.45 U$7.3 5.2,42 5.2,44.6 5.8,45.2 Z4.2
  Route2 0.254: v20.9,16 20.3,16.6 20.3,20.2 18.3,22.2 18.3,26.3 17,27.6 17,30.2 17.8,31 17.8,35.8 15,38.6 11,38.6 9.9,39.7 9.9,41.6 9.6,41.9 v7,41.9
N$12
  Top 0.254: IC2.6 17.9,25.15 17.9,24.8 18.86,23.84 18.86,22.86 C25.1 19.34,21.38 L2.1
N$14
  Top 0.406: USB1.P2 23.62,49.78 23.6,49.8 Z2.2 23.85,49.65 C41.1 23.9,48.45 R22.1
N$15
  Top 0.406: USB1.P3 22.97,49.97 Z1.2 22.65,49.65 C40.1 22.7,48.25 R21.1
N$17  (via drill 0.3)
  Top 0.254: v20.2,13.8 25.9,13.8 26.33,14.23 U4.2 | 12.1,42 U$7.2 | Z5.2 13.1,42.3 12.9,42.1 12.4,42.1 U$7.2 | v9.1,39.4 10,39.4 10.4,39.8 10.4,41.6 10.6,41.8 12.1,41.8 12.3,41.9 U$7.2
  Route2 0.254: v20.2,13.8 19.8,14.2 19.8,20 17.8,22 17.8,26.1 16.6,27.3 16.6,30.4 17.3,31.1 17.3,35.6 14.7,38.1 10.4,38.1 v9.1,39.4
N$18
  pour Top (no thermals): 2.8,9.1 2.8,0.9 14.5,0.9 14.5,16 11.6,16 11.6,18.5 9.2,18.5 9.2,9.1
N$19
  pour Top (rank 3, no thermals): 3.1,14.4 4.6,14.4 4.6,16.5 5.8,16.5 5.8,18.5 8.8,18.5 8.8,11.6 3.1,11.6
N$22  (via drill 0.3)
  Top 0.254: R29.1 v28.4,3.7 | U$15.4 19.05,6.15 v19,6
  Route15 0.254: v28.4,3.7 28.4,4.5 28.1,4.8 19.3,4.8 19,5.1 v19,6
N$23
  Top 0.406: U3.16 31.88,20.38 32.5,21 M3.3 36.61,21 U$9.A
N$24
  Top 0.254: U$15.9 25.3,6.15 R39.1
N$25
  Top 0.254: U4.1 26.95,17.46 26.95,18.15 28.2,19.4 R7.1
N$26
  Top 0.254: U4.5 24.35,17.44 R8.1
N$27
  Top 0.254: U$15.16 R57.1 R47.2
N$29
  Top 0.254: U$15.12 25.3,7.65 R46.1
N$30
  Top 0.406: U3.2 29.53,13.97 29.2,14.3 29.2,21.2 30.39,22.39 U$9.B 36.61,22.4 37.8,22.4 38.21,21.99 M3.4
N$31
  Top 0.406: U3.5 31.88,9.72 34.21,7.39 U$10.B 37.01,7.4 38,7.4 38.41,6.99 M4.4
N$32
  Top 0.406: U3.3 29.51,13.31 29.2,13 29.2,6.9 30.1,6 M4.3 37.01,6 U$10.A
N$33
  Top 0.406: U2.16 31.88,50.58 32.3,51 37.19,51 U$19.A 37.21,51 M1.3
N$34
  Top 0.406: U2.2 29.77,43.83 29.2,44.4 29.2,51.3 30.29,52.39 U$19.B 37.21,52.4 38.1,52.4 38.51,51.99 M1.4
N$35
  Top 0.406: U2.5 31.9,41.58 31.9,39.6 34.1,37.4 37.19,37.4 U$8.B 37.21,37.4 38.1,37.4 38.51,36.99 M2.4
N$36
  Top 0.406: U2.3 29.77,43.17 29.2,42.6 29.2,36.9 30.1,36 M2.3 37.21,36 U$8.A
N$38
  Top 0.305: U2.15 32.52,47.82 R4.2
N$42
  Top 0.305: U2.12 35.37,44.47 35.5,44.6 35.5,46.23 C15.1
N$43
  Top 0.305: U3.9 35.42,12.68 37,11.1 38.01,11.1 C19.2
N$44
  Top 0.406: U3.12 35.01,14.61 35.4,15 35.4,16.36 C18.1
N$45
  Top 0.254: U3.15 32.52,17.61 R5.2
N$62
  Top 0.254: U5.5 36.24,29.34 36.8,29.9 38.25,29.9 R25.1
N$63
  Top 0.254: U5.7 35.48,31.62 R23.1
N$64
  Top 0.254: U5.6 35.91,30.5 36.2,30.8 36.4,30.8 36.6,31 R6.1
N$65
  Top 0.254: U5.8 35.05,30.45 34.7,30.8 34.4,30.8 34.2,31 R24.1
N$66
  Top 0.254: R58.1 R48.2 20.1,3.65 20.1,4.4 20.3,4.6 20.9,4.6 21.15,4.85 U$15.5
N$67
  Top 0.254: U$15.8 22.65,4.65 22.8,4.5 23.5,4.5 23.7,4.3 23.7,3.85 R49.2 R42.1
N$68
  Top 0.254: U$15.13 22.65,8.85 22.8,9 25.05,9 | 25.05,9 R56.1 | 25.05,9 25.05,10 R50.2
NEOPIXEL  (via drill 0.3)
  Top 0.254: v15.5,55.9 15.53,55.88 LED2.1 | IC2.23 25.78,27.3 25.2,27.3 v24.6,27.9
  Route2 0.254: v15.5,55.9 27.9,55.9 28.7,55.1 28.7,48.3 27.5,47.1 27.5,33.5 24.8,30.8 23.3,30.8 22.6,30.1 22.6,29.8 22.4,29.6 22.4,29 22.8,28.6 23.9,28.6 v24.6,27.9
NEOPIXEL_OUT  (via drill 0.3)
  Top 0.305: v16,54.1 16.07,54.12 LED2.3
  Route2 0.305: J1.7 3.45,54.1 v16,54.1
PA03_AREFA
  Top 0.254: IC2.4 17.2,25.87 17.2,24.6 C31.1 17.4,23.72 C32.1
PA28_USB_HOST_EN
  Top 0.254: IC2.41 18.6,32.36 18.6,33.9 18.36,34.14 R28.2
PA30_SWCLK  (via drill 0.3)
  Top 0.254: IC2.45 18.53,29.6 v19.8,29.6 | v17.8,42.3 17.8,43.23 TP2.TP
  Route2 0.254: v17.8,42.3 18.4,41.7 18.4,38.4 20,36.8 19.9,32.3 20.8,31.4 20.8,30.3 20.1,29.6 v19.8,29.6
PA31_SWDIO  (via drill 0.3)
  Top 0.254: IC2.46 17.3,30.12 17.4,30 18.5,28.9 v19.1,28.9 | v19.5,42.3 19.5,43.32 TP5.TP
  Route2 0.254: v19.1,28.9 20.1,28.9 21.3,30.1 21.3,31.7 20.4,32.6 20.4,37.1 18.9,38.6 18.9,41.7 v19.5,42.3
RESET
  Top 0.254: R13.1 19.1,39 | 19.1,39 D1.A 19.1,37.2 19.4,36.9 | 19.1,39 18.1,39 17.7,39.4 17.7,40.73 TP1.TP | R15.2 19.4,35.75 19.4,36.9 | 19.4,37.2 19.4,36.9
RXD  (via drill 0.3)
  Top 0.254: IC2.38 20.68,32.4 21.3,32.4 21.8,32.9 21.8,33.7 v22.2,34.1
  Route2 0.254: v22.2,34.1 23.2,35.1 23.2,36.2 21.4,38 21.4,43.1 20.9,43.6 13.4,43.6 12.9,44.1 12.9,47.8 12.4,48.3 4.9,48.3 4.3,47.7 4.3,43 3.69,42.39 J1.3
SCL  (via drill 0.3)
  Top 0.254: U5.2 36.84,28.05 v37.4,27.5 | IC2.32 22.44,30.5 v22,30.5 | U$6.1 14.94,40.84 15.2,41.1 15.8,41.1 v15.94,41.14 | U4.3 25.66,18.46 26,18.8 v26.6,18.8
  Top 0.305: IC2.32 25.24,33.2 31.5,33.2 v31.8,33.4 31.8,34.41 R16.1 | v15.94,41.14 16.2,41.4 16.2,45.7 15.6,46.3 7.3,46.3 6.9,45.9 4.2,45.9 3.2,44.9 2,44.9 1.97,44.93 J1.4
  Route2 0.203: v26.6,18.8 27.1,19.3 27.1,19.9 26.7,20.3 26.7,21.2 27,21.5 27.8,21.5 28.2,21.9 28.2,25.1 29.3,26.2 29.3,27 31.2,28.9 31.2,33.3 31.3,33.4 v31.8,33.4
  Route2 0.254: v22,30.5 22,30.1 20.1,28.2 18.7,28.2 18.4,28.5 18.4,29.5 19.2,30.3 19.9,30.3 20.3,30.7 20.3,31.2 19.4,32.1 19.4,36.6 15.9,40.1
  Route2 0.305: v31.8,33.4 32.1,33.4 32.3,33.2 36.7,33.2 38,31.9 38,27.7 37.8,27.5 v37.4,27.5 | 15.9,40.1 15.9,41 16,41.2 15.94,41.06 v15.94,41.14
SDA  (via drill 0.3)
  Top 0.254: U5.4 36.88,28.91 v37.2,29.2 | IC2.31 22.95,30.2 22.7,30.2 21.5,29 v21.5,28.6 | U4.7 23.07,18.43 22.9,18.6 21.8,18.6 21.3,19.1 21.3,19.9 22,20.6 v27.3,20.6 | v11.66,39.84 11.72,39.9 U$6.3
  Top 0.305: R3.1 31.8,31.57 v31.8,32.5 31.5,32.7 25.45,32.7 IC2.31 | v11.5,47 7.1,47 6.5,46.4 4.3,46.4 3.23,47.47 J1.5
  Route2 0.203: v27.3,20.6 28.3,20.6 28.6,20.9 28.6,24.9 29.7,26 29.7,26.8 31.8,28.9 v31.8,32.5
  Route2 0.254: v21.5,28.6 20.6,27.7 18.5,27.7 17.9,28.3 17.9,29.7 18.7,30.5 18.7,36.6 15.46,39.84 v11.66,39.84 11.5,39.88 v11.5,47
  Route2 0.305: v31.8,32.5 32.1,32.5 32.3,32.7 36.4,32.7 37.2,31.9 v37.2,29.2
TARGET_RESET_EDBG
  Top 0.254: IC2.40 19,32.67 19,33.2 19.85,34.05 20.75,34.95 R15.1
  Top 0.305: C30.1 17.7,36.5 18.6,35.6 18.6,35.2 19.85,34.05
TXD  (via drill 0.3)
  Top 0.254: IC2.37 20.89,32.9 21.2,32.9 21.3,33 21.3,34.6 v21.6,34.9
  Route2 0.254: v21.6,34.9 21.6,37.1 20.9,37.8 20.9,42.8 20.6,43.1 13.2,43.1 12.4,43.9 12.4,47.4 12,47.8 5.2,47.8 4.8,47.4 4.8,40.6 4.05,39.85 J1.2
VDDCORE
  Top 0.305: IC2.43 17.9,31.65 17.9,33 17.41,33.49 C23.1
XTAL_IN
  Top 0.254: IC2.1 15.91,26.7 14.4,26.7 14.1,27 Y1.P$2 14.1,29.35 C26.2
XTAL_OUT
  Top 0.254: IC2.2 16.02,26.1 14.4,26.1 14.1,25.8 Y1.P$1 14.1,23.45 C27.2